# EAGLE design Memory V1.2 (EAGLE 9.6.2)

## Sheet 1 of 6: BUS
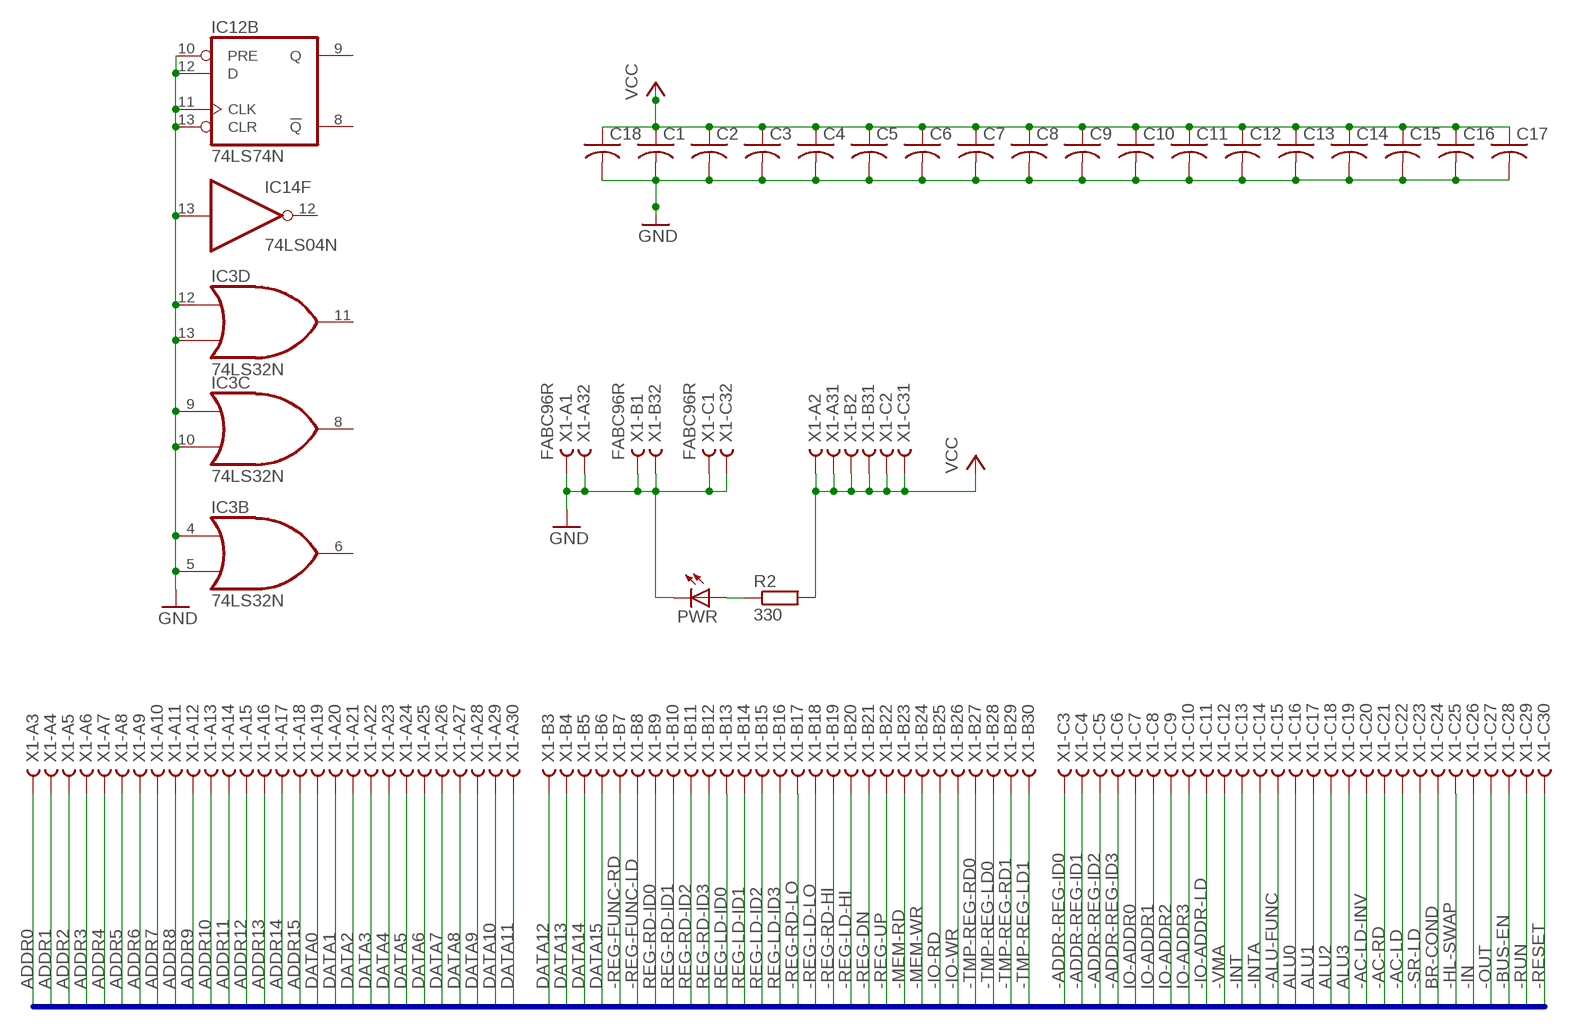
[diagram p0: schematic, sheet 1]

### Parts
C1  C-US025-025X050  [C025-025X050]
C2  C-US025-025X050  [C025-025X050]
C3  C-US025-025X050  [C025-025X050]
C4  C-US025-025X050  [C025-025X050]
C5  C-US025-025X050  [C025-025X050]
C6  C-US025-025X050  [C025-025X050]
C7  C-US025-025X050  [C025-025X050]
C8  C-US025-025X050  [C025-025X050]
C9  C-US025-025X050  [C025-025X050]
C10  C-US025-025X050  [C025-025X050]
C11  C-US025-025X050  [C025-025X050]
C12  C-US025-025X050  [C025-025X050]
C13  C-US025-025X050  [C025-025X050]
C14  C-US025-025X050  [C025-025X050]
C15  C-US025-025X050  [C025-025X050]
C16  C-US025-025X050  [C025-025X050]
C17  C-US025-025X050  [C025-025X050]
C18  C-US025-025X050  [C025-025X050]
IC3  74LS32N  [DIL14]
IC12  74LS74N  [DIL14]
IC14  74LS04N  [DIL14]
PWR  LED5MM  [LED5MM]
R2  330  R0207/10  [0207/10]
X1  FABC96R  [FABC96R]

### Nets
-AC-LD: X1.C22
-AC-LD-INV: X1.C20
-AC-RD: X1.C21
-ADDR-REG-ID0: X1.C3
-ADDR-REG-ID1: X1.C4
-ADDR-REG-ID2: X1.C5
-ADDR-REG-ID3: X1.C6
-ALU-FUNC: X1.C15
-BUS-EN: X1.C28 ; also sheet 2
-HL-SWAP: X1.C25
-IN: X1.C26
-INT: X1.C13
-INTA: X1.C14
-IO-ADDR-LD: X1.C11
-IO-RD: X1.B25
-IO-WR: X1.B26
-MEM-RD: X1.B23 ; also sheet 3,5
-MEM-WR: X1.B24 ; also sheet 3
-OUT: X1.C27
-REG-DN: X1.B21
-REG-FUNC-LD: X1.B8
-REG-FUNC-RD: X1.B7
-REG-LD-HI: X1.B20
-REG-LD-LO: X1.B18
-REG-RD-HI: X1.B19
-REG-RD-LO: X1.B17
-REG-UP: X1.B22
-RESET: X1.C30 ; also sheet 2
-RUN: X1.C29
-SR-LD: X1.C23
-TMP-REG-LD0: X1.B28 ; also sheet 6
-TMP-REG-LD1: X1.B30 ; also sheet 6
-TMP-REG-RD0: X1.B27 ; also sheet 6
-TMP-REG-RD1: X1.B29 ; also sheet 6
-VMA: X1.C12 ; also sheet 2,3,5
ADDR0: X1.A3 ; also sheet 4
ADDR1: X1.A4 ; also sheet 4
ADDR2: X1.A5 ; also sheet 4
ADDR3: X1.A6 ; also sheet 4
ADDR4: X1.A7 ; also sheet 4
ADDR5: X1.A8 ; also sheet 4
ADDR6: X1.A9 ; also sheet 4
ADDR7: X1.A10 ; also sheet 4
ADDR8: X1.A11 ; also sheet 4
ADDR9: X1.A12 ; also sheet 4
ADDR10: X1.A13 ; also sheet 4
ADDR11: X1.A14 ; also sheet 4
ADDR12: X1.A15 ; also sheet 4
ADDR13: X1.A16 ; also sheet 4
ADDR14: X1.A17 ; also sheet 4
ADDR15: X1.A18 ; also sheet 2,4
ALU0: X1.C16
ALU1: X1.C17
ALU2: X1.C18
ALU3: X1.C19
BR-COND: X1.C24
DATA0: X1.A19 ; also sheet 5,6
DATA1: X1.A20 ; also sheet 5,6
DATA2: X1.A21 ; also sheet 5,6
DATA3: X1.A22 ; also sheet 5,6
DATA4: X1.A23 ; also sheet 5,6
DATA5: X1.A24 ; also sheet 5,6
DATA6: X1.A25 ; also sheet 5,6
DATA7: X1.A26 ; also sheet 5,6
DATA8: X1.A27 ; also sheet 6
DATA9: X1.A28 ; also sheet 6
DATA10: X1.A29 ; also sheet 6
DATA11: X1.A30 ; also sheet 6
DATA12: X1.B3 ; also sheet 6
DATA13: X1.B4 ; also sheet 6
DATA14: X1.B5 ; also sheet 6
DATA15: X1.B6 ; also sheet 6
GND: C1.2 C2.2 C3.2 C4.2 C5.2 C6.2 C7.2 C8.2 C9.2 C10.2 C11.2 C12.2 C13.2 C14.2 C15.2 C16.2 C17.2 C18.2 IC3.4(B:I0) IC3.5(B:I1) IC3.9(C:I0) IC3.10(C:I1) IC3.12(D:I0) IC3.13(D:I1) IC12.10(B:PRE) IC12.11(B:CLK) IC12.12(B:D) IC12.13(B:CLR) IC14.13(F:I) PWR.K(C) X1.A1 X1.A32 X1.B1 X1.B32 X1.C1 X1.C32 ; also sheet 2,3,4,6
IO-ADDR0: X1.C7
IO-ADDR1: X1.C8
IO-ADDR2: X1.C9
IO-ADDR3: X1.C10
N$11: PWR.A R2.1
REG-LD-ID0: X1.B13
REG-LD-ID1: X1.B14
REG-LD-ID2: X1.B15
REG-LD-ID3: X1.B16
REG-RD-ID0: X1.B9
REG-RD-ID1: X1.B10
REG-RD-ID2: X1.B11
REG-RD-ID3: X1.B12
VCC: C1.1 C2.1 C3.1 C4.1 C5.1 C6.1 C7.1 C8.1 C9.1 C10.1 C11.1 C12.1 C13.1 C14.1 C15.1 C16.1 C17.1 C18.1 R2.2 X1.A2 X1.A31 X1.B2 X1.B31 X1.C2 X1.C31 ; also sheet 2,3,4,5
Unconnected: IC3.6(B:O) IC3.8(C:O) IC3.11(D:O) IC12.8(B:!Q) IC12.9(B:Q) IC14.12(F:O)

### Buses
MAINBUS:-AC-LD,-AC-LD-INV,-AC-RD,ADDR[0..15],-ADDR-REG-LD[0..1],-ADDR-REG-RD[0..1],ALU[0..3],-ALU-FUNC,BR-COND,-BUS-EN,DATA[0..15],-HL-SWAP,-IN,-INT,-INTA,IO-ADDR[0..3],-IO-ADDR-LD,-IO-RD,-IO-WR,-MEM-RD,-MEM-WR,-OUT,-REG-DN,-REG-FUNC-LD,-REG-FUNC-RD,-REG-LD-HI,REG-LD-ID[0..3],-REG-LD-LO,-REG-RD-HI,REG-RD-ID[0..3],-REG-RD-LO,-REG-UP,-RESET,-RUN,-SR-LD,-TMP-REG-LD[0..1],-TMP-REG-RD[0..1],-VMA

## Sheet 2 of 6: Memory Select
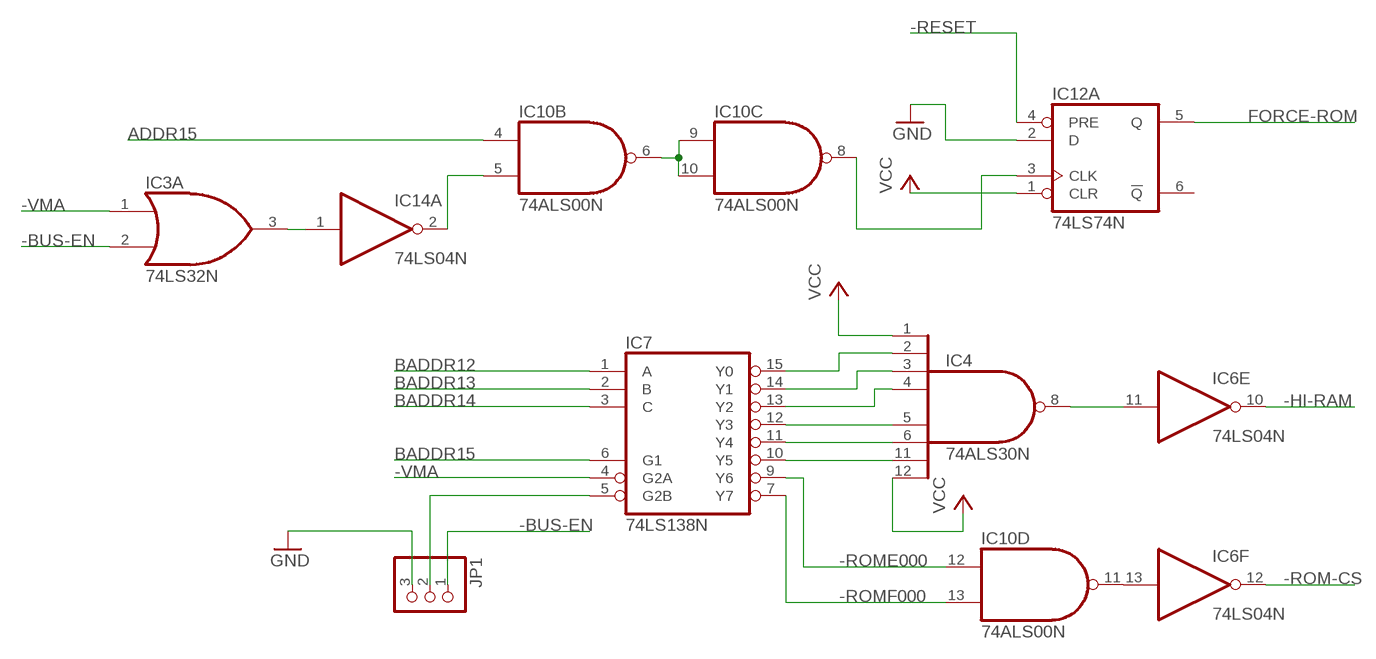
[diagram p1: schematic, sheet 2]

### Parts
IC4  74ALS30N  [DIL14]
IC6  74LS04N  [DIL14]
IC7  74LS138N  [DIL16]
IC10  74ALS00N  [DIL14]
JP1  PINHD-1X3  [1X03]

### Nets
-BUS-EN: IC3.2(A:I1) JP1.1 ; also sheet 1
-HI-RAM: IC6.10(E:O) ; also sheet 3
-RESET: IC12.4(A:PRE) ; also sheet 1
-ROM-CS: IC6.12(F:O) ; also sheet 3
-ROME000: IC7.9(Y6) IC10.12(D:I0)
-ROMF000: IC7.7(Y7) IC10.13(D:I1)
-VMA: IC3.1(A:I0) IC7.4(G2A) ; also sheet 1,3,5
ADDR15: IC10.4(B:I0) ; also sheet 1,4
BADDR12: IC7.1(A) ; also sheet 3,4
BADDR13: IC7.2(B) ; also sheet 3,4
BADDR14: IC7.3(C) ; also sheet 3,4
BADDR15: IC7.6(G1) ; also sheet 3,4
FORCE-ROM: IC12.5(A:Q) ; also sheet 4
GND: IC12.2(A:D) JP1.3 ; also sheet 1,3,4,6
N$1: IC6.13(F:I) IC10.11(D:O)
N$5: IC4.11(I6) IC7.10(Y5)
N$6: IC4.6(I5) IC7.11(Y4)
N$7: IC4.5(I4) IC7.12(Y3)
N$8: IC4.4(I3) IC7.13(Y2)
N$9: IC4.3(I2) IC7.14(Y1)
N$10: IC4.2(I1) IC7.15(Y0)
N$14: IC4.8(O) IC6.11(E:I)
N$19: IC10.8(C:O) IC12.3(A:CLK)
N$20: IC10.6(B:O) IC10.9(C:I0) IC10.10(C:I1)
N$22: IC10.5(B:I1) IC14.2(A:O)
N$24: IC7.5(G2B) JP1.2
N$25: IC3.3(A:O) IC14.1(A:I)
VCC: IC4.1(I0) IC4.12(I7) IC12.1(A:CLR) ; also sheet 1,3,4,5
Unconnected: IC12.6(A:!Q)

## Sheet 3 of 6: Memory
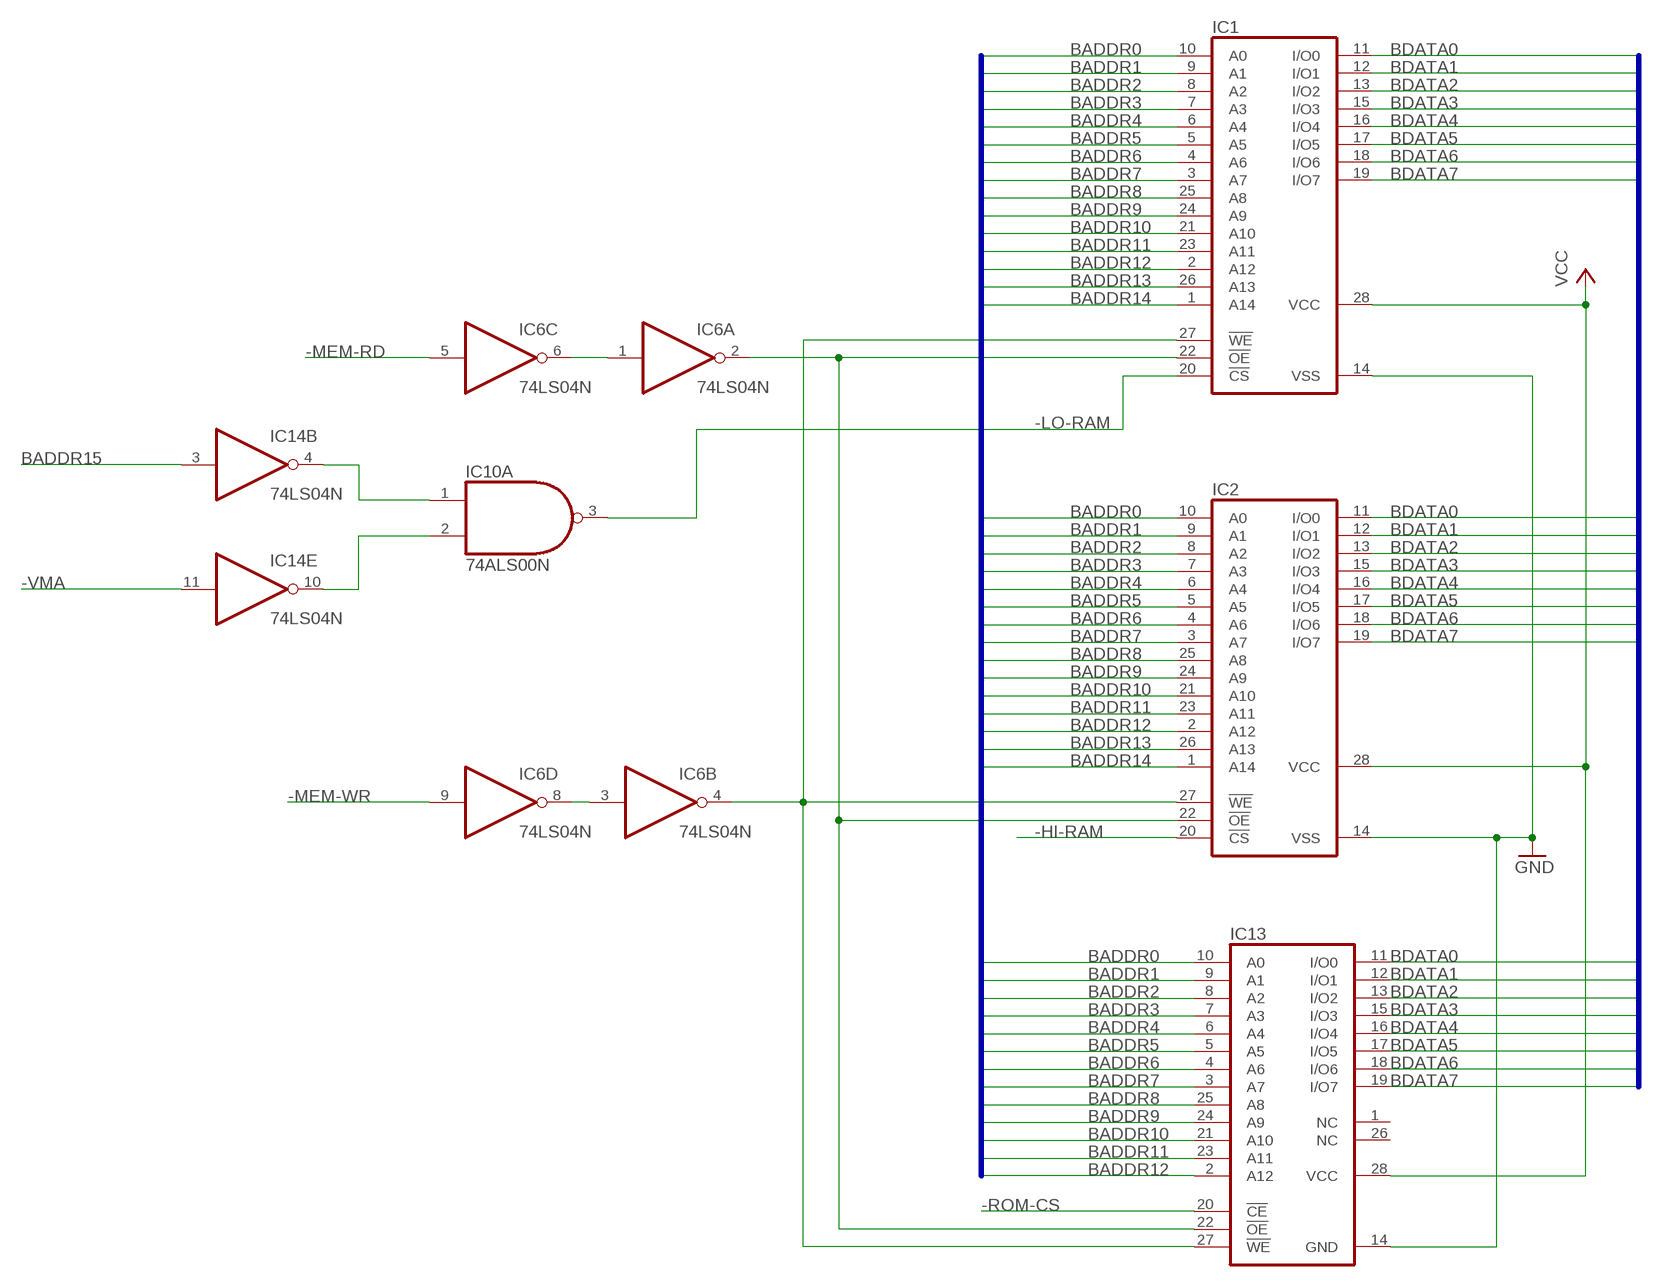
[diagram p2: schematic, sheet 3]

### Parts
IC1  62256P  [DIL28-6]
IC2  62256P  [DIL28-6]
IC13  28C64C  [DIL28-6]

### Nets
-HI-RAM: IC2.20(!CS) ; also sheet 2
-LO-RAM: IC1.20(!CS) IC10.3(A:O)
-MEM-RD: IC6.5(C:I) ; also sheet 1,5
-MEM-WR: IC6.9(D:I) ; also sheet 1
-ROM-CS: IC13.20(!CE) ; also sheet 2
-VMA: IC14.11(E:I) ; also sheet 1,2,5
BADDR0: IC1.10(A0) IC2.10(A0) IC13.10(A0) ; also sheet 4
BADDR1: IC1.9(A1) IC2.9(A1) IC13.9(A1) ; also sheet 4
BADDR2: IC1.8(A2) IC2.8(A2) IC13.8(A2) ; also sheet 4
BADDR3: IC1.7(A3) IC2.7(A3) IC13.7(A3) ; also sheet 4
BADDR4: IC1.6(A4) IC2.6(A4) IC13.6(A4) ; also sheet 4
BADDR5: IC1.5(A5) IC2.5(A5) IC13.5(A5) ; also sheet 4
BADDR6: IC1.4(A6) IC2.4(A6) IC13.4(A6) ; also sheet 4
BADDR7: IC1.3(A7) IC2.3(A7) IC13.3(A7) ; also sheet 4
BADDR8: IC1.25(A8) IC2.25(A8) IC13.25(A8) ; also sheet 4
BADDR9: IC1.24(A9) IC2.24(A9) IC13.24(A9) ; also sheet 4
BADDR10: IC1.21(A10) IC2.21(A10) IC13.21(A10) ; also sheet 4
BADDR11: IC1.23(A11) IC2.23(A11) IC13.23(A11) ; also sheet 4
BADDR12: IC1.2(A12) IC2.2(A12) IC13.2(A12) ; also sheet 2,4
BADDR13: IC1.26(A13) IC2.26(A13) ; also sheet 2,4
BADDR14: IC1.1(A14) IC2.1(A14) ; also sheet 2,4
BADDR15: IC14.3(B:I) ; also sheet 2,4
BDATA0: IC1.11(I/O0) IC2.11(I/O0) IC13.11(I/O0) ; also sheet 5
BDATA1: IC1.12(I/O1) IC2.12(I/O1) IC13.12(I/O1) ; also sheet 5
BDATA2: IC1.13(I/O2) IC2.13(I/O2) IC13.13(I/O2) ; also sheet 5
BDATA3: IC1.15(I/O3) IC2.15(I/O3) IC13.15(I/O3) ; also sheet 5
BDATA4: IC1.16(I/O4) IC2.16(I/O4) IC13.16(I/O4) ; also sheet 5
BDATA5: IC1.17(I/O5) IC2.17(I/O5) IC13.17(I/O5) ; also sheet 5
BDATA6: IC1.18(I/O6) IC2.18(I/O6) IC13.18(I/O6) ; also sheet 5
BDATA7: IC1.19(I/O7) IC2.19(I/O7) IC13.19(I/O7) ; also sheet 5
GND: IC1.14(VSS) IC2.14(VSS) IC13.14(GND) ; also sheet 1,2,4,6
MEM-RD: IC6.1(A:I) IC6.6(C:O)
N$2: IC6.3(B:I) IC6.8(D:O)
N$3: IC1.22(!OE) IC2.22(!OE) IC6.2(A:O) IC13.22(!OE)
N$4: IC1.27(!WE) IC2.27(!WE) IC6.4(B:O) IC13.27(!WE)
N$12: IC10.2(A:I1) IC14.10(E:O)
N$13: IC10.1(A:I0) IC14.4(B:O)
VCC: IC1.28(VCC) IC2.28(VCC) IC13.28(VCC) ; also sheet 1,2,4,5
Unconnected: IC13.1(NC) IC13.26(NC)

### Buses
BADDR[0..15]
BDATA[0..7]

## Sheet 4 of 6: Adress Buffering
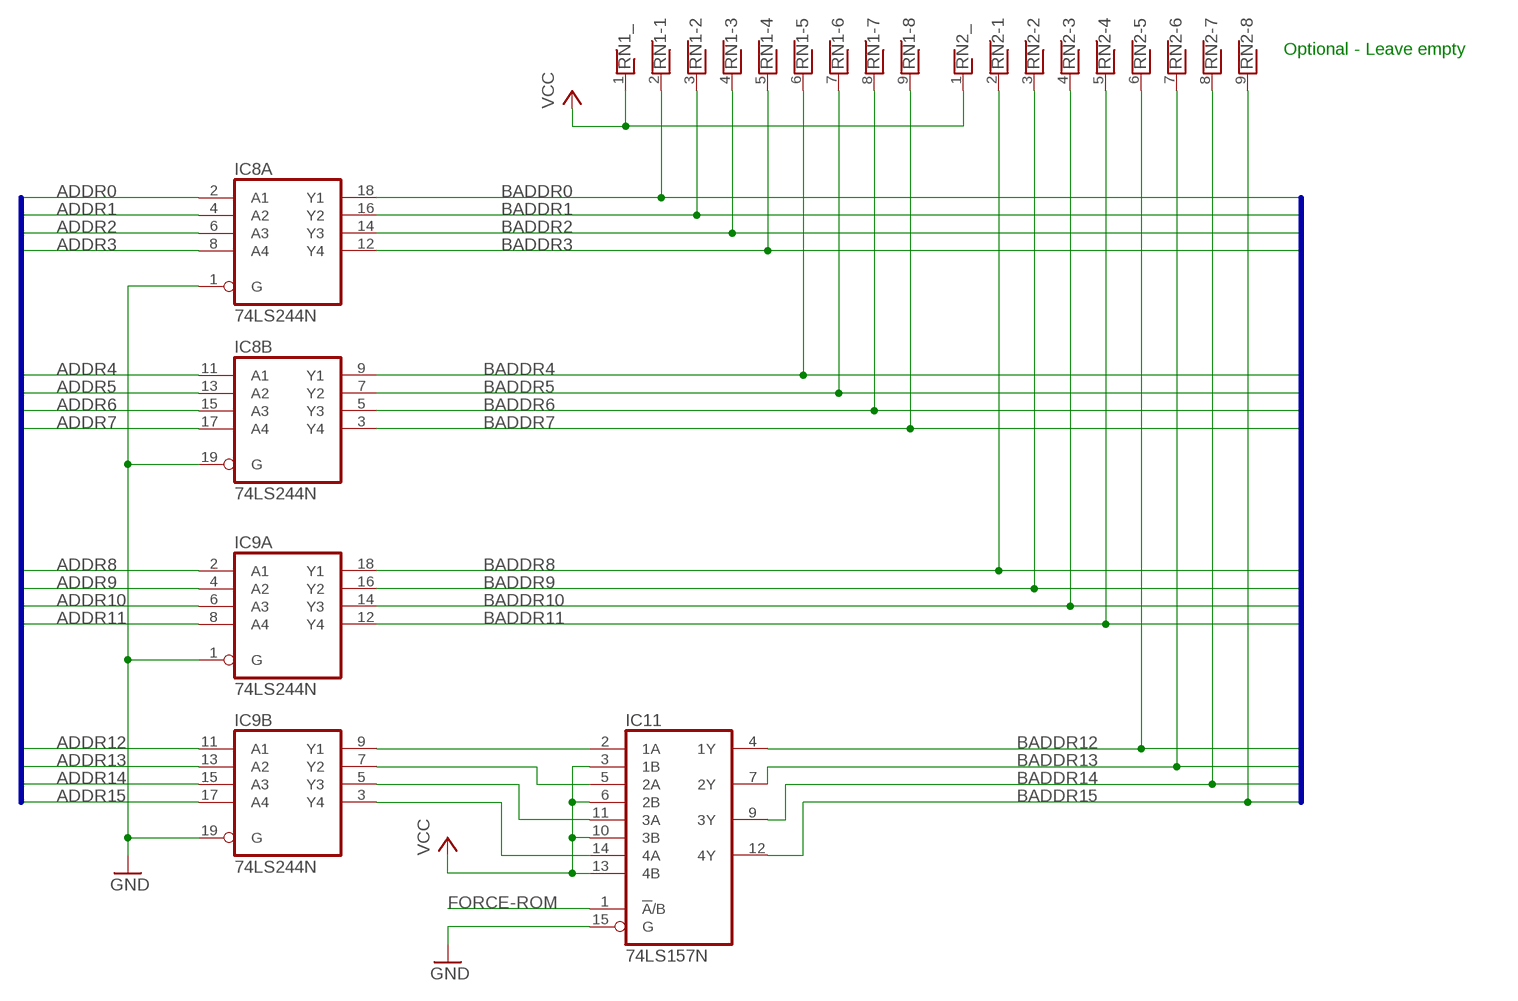
[diagram p3: schematic, sheet 4]

### Parts
IC8  74LS244N  [DIL20]
IC9  74LS244N  [DIL20]
IC11  74LS157N  [DIL16]
RN1  RNX8  [RN-9]
RN2  RNX8  [RN-9]

### Nets
ADDR0: IC8.2(A:A1) ; also sheet 1
ADDR1: IC8.4(A:A2) ; also sheet 1
ADDR2: IC8.6(A:A3) ; also sheet 1
ADDR3: IC8.8(A:A4) ; also sheet 1
ADDR4: IC8.11(B:A1) ; also sheet 1
ADDR5: IC8.13(B:A2) ; also sheet 1
ADDR6: IC8.15(B:A3) ; also sheet 1
ADDR7: IC8.17(B:A4) ; also sheet 1
ADDR8: IC9.2(A:A1) ; also sheet 1
ADDR9: IC9.4(A:A2) ; also sheet 1
ADDR10: IC9.6(A:A3) ; also sheet 1
ADDR11: IC9.8(A:A4) ; also sheet 1
ADDR12: IC9.11(B:A1) ; also sheet 1
ADDR13: IC9.13(B:A2) ; also sheet 1
ADDR14: IC9.15(B:A3) ; also sheet 1
ADDR15: IC9.17(B:A4) ; also sheet 1,2
BADDR0: IC8.18(A:Y1) RN1.2 ; also sheet 3
BADDR1: IC8.16(A:Y2) RN1.3 ; also sheet 3
BADDR2: IC8.14(A:Y3) RN1.4 ; also sheet 3
BADDR3: IC8.12(A:Y4) RN1.5 ; also sheet 3
BADDR4: IC8.9(B:Y1) RN1.6 ; also sheet 3
BADDR5: IC8.7(B:Y2) RN1.7 ; also sheet 3
BADDR6: IC8.5(B:Y3) RN1.8 ; also sheet 3
BADDR7: IC8.3(B:Y4) RN1.9 ; also sheet 3
BADDR8: IC9.18(A:Y1) RN2.2 ; also sheet 3
BADDR9: IC9.16(A:Y2) RN2.3 ; also sheet 3
BADDR10: IC9.14(A:Y3) RN2.4 ; also sheet 3
BADDR11: IC9.12(A:Y4) RN2.5 ; also sheet 3
BADDR12: IC11.4(1Y) RN2.6 ; also sheet 2,3
BADDR13: IC11.7(2Y) RN2.7 ; also sheet 2,3
BADDR14: IC11.9(3Y) RN2.8 ; also sheet 2,3
BADDR15: IC11.12(4Y) RN2.9 ; also sheet 2,3
FORCE-ROM: IC11.1(!A!/B) ; also sheet 2
GND: IC8.1(A:G) IC8.19(B:G) IC9.1(A:G) IC9.19(B:G) IC11.15(G) ; also sheet 1,2,3,6
N$15: IC9.9(B:Y1) IC11.2(1A)
N$16: IC9.7(B:Y2) IC11.5(2A)
N$17: IC9.5(B:Y3) IC11.11(3A)
N$18: IC9.3(B:Y4) IC11.14(4A)
VCC: IC11.3(1B) IC11.6(2B) IC11.10(3B) IC11.13(4B) RN1.1 RN2.1 ; also sheet 1,2,3,5

### Buses
ADDR0,ADDR1,ADDR2,ADDR3,ADDR4,ADDR5,ADDR6,ADDR7,ADDR8,ADDR9,ADDR10,ADDR11,ADDR12,ADDR13,ADDR14,ADDR15
BADDR[0..15]

### Notes on the sheet
- Optional - Leave empty

## Sheet 5 of 6: Data Buffer
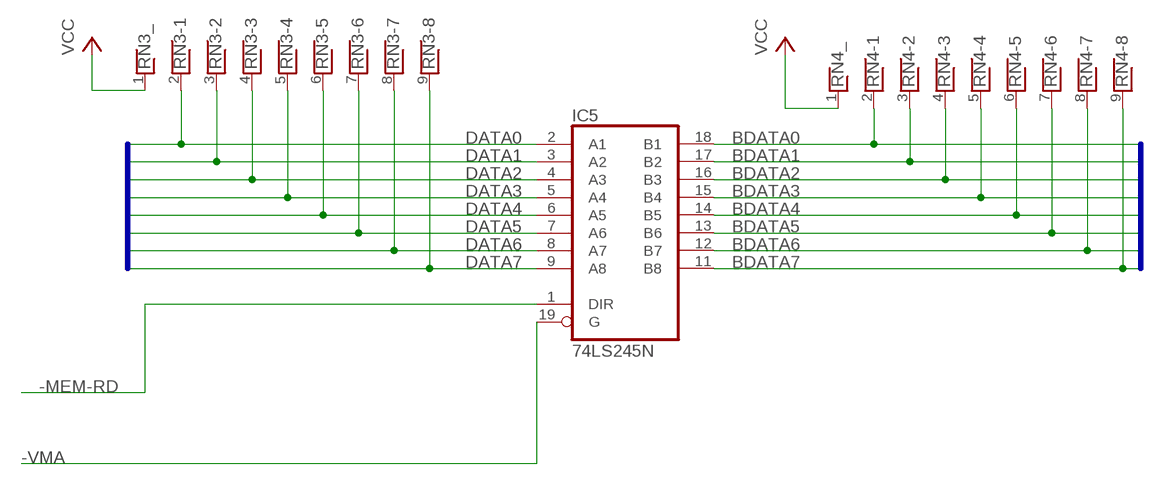
[diagram p4: schematic, sheet 5]

### Parts
IC5  74LS245N  [DIL20]
RN3  RNX8  [RN-9]
RN4  RNX8  [RN-9]

### Nets
-MEM-RD: IC5.1(DIR) ; also sheet 1,3
-VMA: IC5.19(G) ; also sheet 1,2,3
BDATA0: IC5.18(B1) RN4.2 ; also sheet 3
BDATA1: IC5.17(B2) RN4.3 ; also sheet 3
BDATA2: IC5.16(B3) RN4.4 ; also sheet 3
BDATA3: IC5.15(B4) RN4.5 ; also sheet 3
BDATA4: IC5.14(B5) RN4.6 ; also sheet 3
BDATA5: IC5.13(B6) RN4.7 ; also sheet 3
BDATA6: IC5.12(B7) RN4.8 ; also sheet 3
BDATA7: IC5.11(B8) RN4.9 ; also sheet 3
DATA0: IC5.2(A1) RN3.2 ; also sheet 1,6
DATA1: IC5.3(A2) RN3.3 ; also sheet 1,6
DATA2: IC5.4(A3) RN3.4 ; also sheet 1,6
DATA3: IC5.5(A4) RN3.5 ; also sheet 1,6
DATA4: IC5.6(A5) RN3.6 ; also sheet 1,6
DATA5: IC5.7(A6) RN3.7 ; also sheet 1,6
DATA6: IC5.8(A7) RN3.8 ; also sheet 1,6
DATA7: IC5.9(A8) RN3.9 ; also sheet 1,6
VCC: RN3.1 RN4.1 ; also sheet 1,2,3,4

### Buses
DATA[0..7]
BDATA0,BDATA1,BDATA2,BDATA3,BDATA4,BDATA5,BDATA6,BDATA7

## Sheet 6 of 6
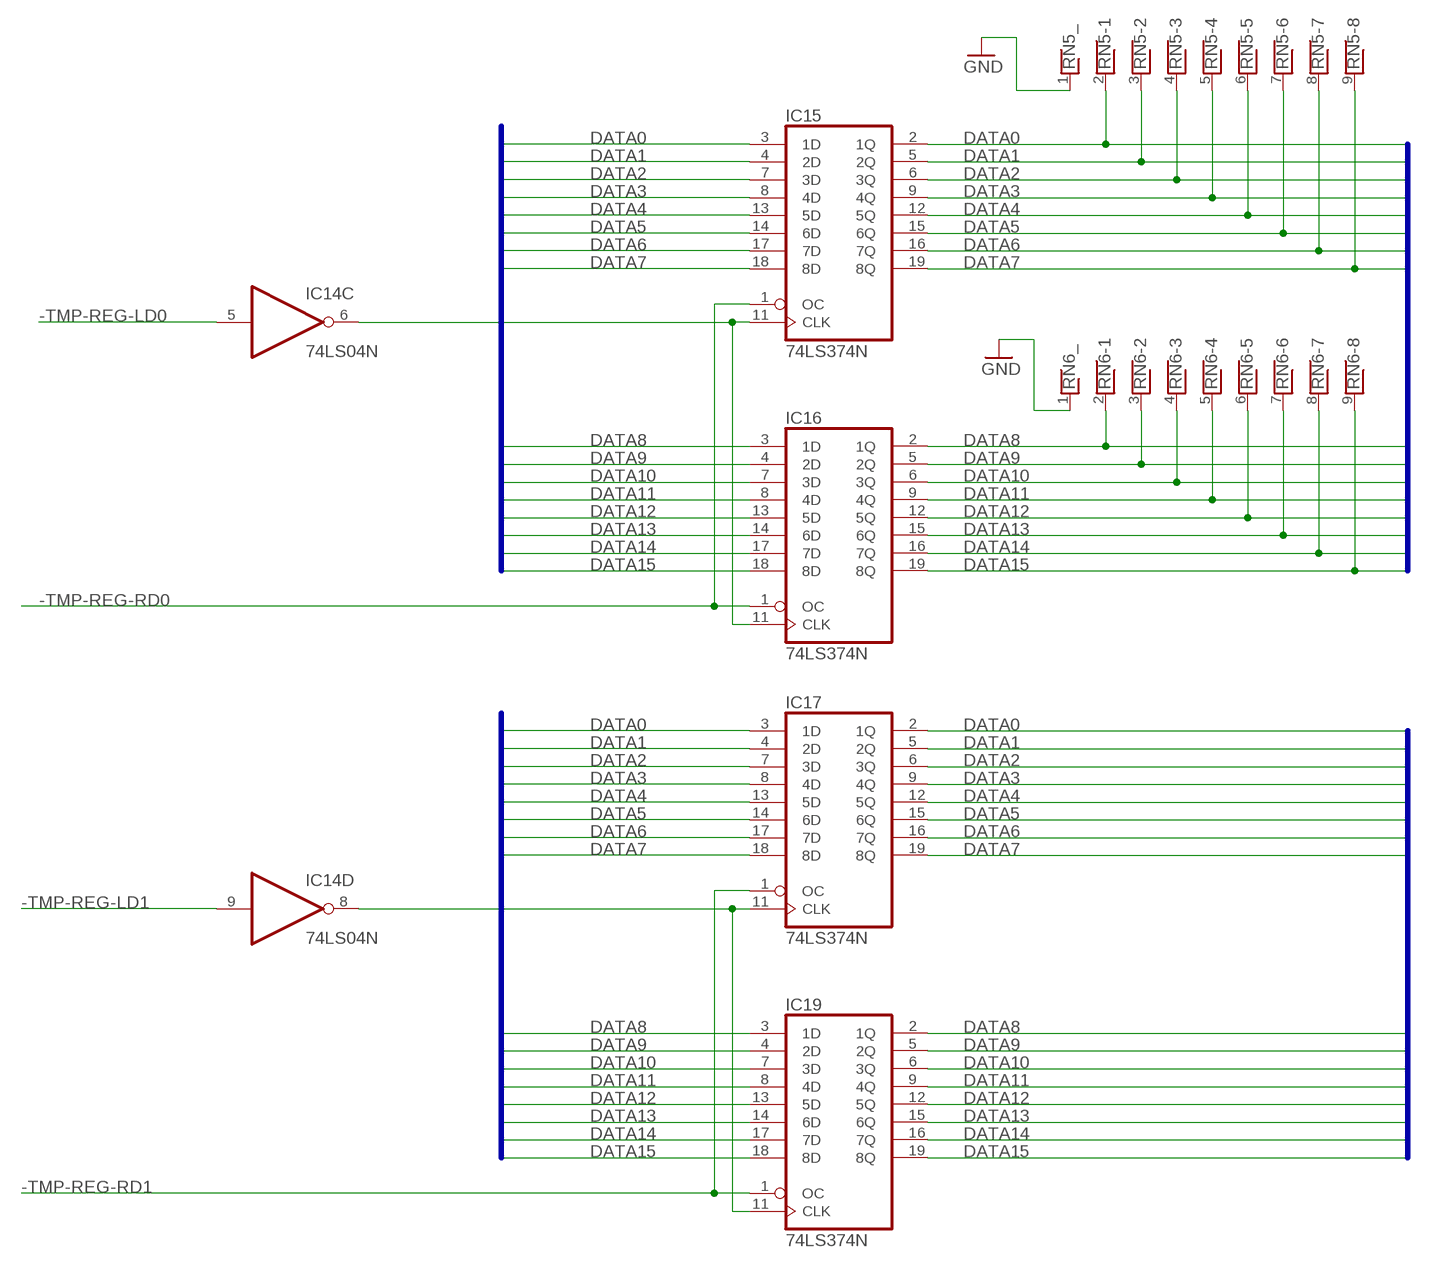
[diagram p5: schematic, sheet 6]

### Parts
IC15  74LS374N  [DIL20]
IC16  74LS374N  [DIL20]
IC17  74LS374N  [DIL20]
IC19  74LS374N  [DIL20]
RN5  RNX8  [RN-9]
RN6  RNX8  [RN-9]

### Nets
-TMP-REG-LD0: IC14.5(C:I) ; also sheet 1
-TMP-REG-LD1: IC14.9(D:I) ; also sheet 1
-TMP-REG-RD0: IC15.1(OC) IC16.1(OC) ; also sheet 1
-TMP-REG-RD1: IC17.1(OC) IC19.1(OC) ; also sheet 1
DATA0: IC15.2(1Q) IC15.3(1D) IC17.2(1Q) IC17.3(1D) RN5.2 ; also sheet 1,5
DATA1: IC15.4(2D) IC15.5(2Q) IC17.4(2D) IC17.5(2Q) RN5.3 ; also sheet 1,5
DATA2: IC15.6(3Q) IC15.7(3D) IC17.6(3Q) IC17.7(3D) RN5.4 ; also sheet 1,5
DATA3: IC15.8(4D) IC15.9(4Q) IC17.8(4D) IC17.9(4Q) RN5.5 ; also sheet 1,5
DATA4: IC15.12(5Q) IC15.13(5D) IC17.12(5Q) IC17.13(5D) RN5.6 ; also sheet 1,5
DATA5: IC15.14(6D) IC15.15(6Q) IC17.14(6D) IC17.15(6Q) RN5.7 ; also sheet 1,5
DATA6: IC15.16(7Q) IC15.17(7D) IC17.16(7Q) IC17.17(7D) RN5.8 ; also sheet 1,5
DATA7: IC15.18(8D) IC15.19(8Q) IC17.18(8D) IC17.19(8Q) RN5.9 ; also sheet 1,5
DATA8: IC16.2(1Q) IC16.3(1D) IC19.2(1Q) IC19.3(1D) RN6.2 ; also sheet 1
DATA9: IC16.4(2D) IC16.5(2Q) IC19.4(2D) IC19.5(2Q) RN6.3 ; also sheet 1
DATA10: IC16.6(3Q) IC16.7(3D) IC19.6(3Q) IC19.7(3D) RN6.4 ; also sheet 1
DATA11: IC16.8(4D) IC16.9(4Q) IC19.8(4D) IC19.9(4Q) RN6.5 ; also sheet 1
DATA12: IC16.12(5Q) IC16.13(5D) IC19.12(5Q) IC19.13(5D) RN6.6 ; also sheet 1
DATA13: IC16.14(6D) IC16.15(6Q) IC19.14(6D) IC19.15(6Q) RN6.7 ; also sheet 1
DATA14: IC16.16(7Q) IC16.17(7D) IC19.16(7Q) IC19.17(7D) RN6.8 ; also sheet 1
DATA15: IC16.18(8D) IC16.19(8Q) IC19.18(8D) IC19.19(8Q) RN6.9 ; also sheet 1
GND: RN5.1 RN6.1 ; also sheet 1,2,3,4
N$21: IC14.6(C:O) IC15.11(CLK) IC16.11(CLK)
N$23: IC14.8(D:O) IC17.11(CLK) IC19.11(CLK)

### Buses
DATABUS:DATA[0..15]

## Power pins joined to a net without a drawn wire
GND: IC3.7(P:GND) IC4.7(GND) IC5.10(GND) IC6.7(P:GND) IC7.8(GND) IC8.10(P:GND) IC9.10(P:GND) IC10.7(P:GND) IC11.8(GND) IC12.7(P:GND) IC14.7(P:GND) IC15.10(GND) IC16.10(GND) IC17.10(GND) IC19.10(GND)
VCC: IC3.14(P:VCC) IC4.14(VCC) IC5.20(VCC) IC6.14(P:VCC) IC7.16(VCC) IC8.20(P:VCC) IC9.20(P:VCC) IC10.14(P:VCC) IC11.16(VCC) IC12.14(P:VCC) IC14.14(P:VCC) IC15.20(VCC) IC16.20(VCC) IC17.20(VCC) IC19.20(VCC)

## Library data of the parts
C1-C18 = adafruit:C-US: CAPACITOR, American symbol
IC1 IC2 = memory-hitachi:62256P: MEMORY; OC_FARNELL: unknown; OC_NEWARK: unknown
IC3 = 74xx-us:74*32: Quad 2-input OR gate
IC4 = 74xx-us:74*30: 8-input NAND gate
IC5 = adafruit:74*245: Octal BUS TRANSCEIVER, 3-state
IC6 IC14 = 74xx-us:74*04: Hex INVERTER
IC7 = 74xx-us:74*138: 3-line to 8-line DECODER/DEMULTIPLEXER
IC8 IC9 = 74xx-us:74*244: Octal BUFFER and LINE DRIVER, 3-state
IC10 = 74xx-us:74*00: Quad 2-input NAND gate
IC11 = 74xx-us:74*157: Quadruple 2-line to 1-line data SELECTOR/MULTIPLEXER
IC12 = 74xx-us:74*74: Dual D type positive edge triggered FLIP FLOP, preset and clear
IC13 = memory-nec:28C64C: MEMORY; MPN: AT28C64B-15PU; OC_FARNELL: 1095784; OC_NEWARK: 96K6557
IC15-IC17 IC19 = 74xx-us:74*374: Octal D type transparent LATCH, edge triggered
JP1 = pinhead:PINHD-1X3: PIN HEADER
PWR = led:LED: LED OSRAM: - CHIPLED LG R971, LG N971, LY N971, LG Q971, LY Q971, LO R971, LY R971 LH N974, LH R974 LS Q976, LO Q976, LY Q976 LO Q996 - Hyper CHIPLED LW Q18S LB Q993, LB Q99A, LB R99A - SideLED LS A670, LO A670, LY A670, LG A670, LP A670 LB A673, LV A673, LT A673, LW A673 LH A674 LY A675 LS A676, LA A676, LO A676, LY A676, LW A676 LS A679, LY A679, LG A679 - Hyper Micro SIDELED® LS Y876, LA Y876, LO Y876, LY Y876 LT Y87S - SmartLED LW L88C, LW L88S LB L89C, LB L89S, LG L890 LS L89K, LO L89K, LY L89K LS L896, LA L896, LO L896, LY L896 - TOPLED LS T670, LO T670, LY T670, LG T670, LP T670 LSG T670, LSP T670, LSY T670, LOP T670, LYG T670 LG T671, LOG T671, LSG T671 LB T673, LV T673, LT T673, LW T673 LH T674 LS T676, LA T676, LO T676, LY T676, LB T676, LH T676, LSB T676, LW T676 LB T67C, LV T67C, LT T67C, LS T67K, LO T67K, LY T67K, LW E67C LS E67B, LA E67B, LO E67B, LY E67B, LB E67C, LV E67C, LT E67C LW T67C LS T679, LY T679, LG T679 LS T770, LO T770, LY T770, LG T770, LP T770 LB T773, LV T773, LT T773, LW T773 LH T774 LS E675, LA E675, LY E675, LS T675 LS T776, LA T776, LO T776, LY T776, LB T776 LHGB T686 LT T68C, LB T68C - Hyper Mini TOPLED® LB M676 - Mini TOPLED Santana® LG M470 LS M47K, LO M47K, LY M47K Source: http://www.osram.convergy.de LUXEON: - LUMILED® LXK2-PW12-R00, LXK2-PW12-S00, LXK2-PW14-U00, LXK2-PW14-V00 LXK2-PM12-R00, LXK2-PM12-S00, LXK2-PM14-U00 LXK2-PE12-Q00, LXK2-PE12-R00, LXK2-PE12-S00, LXK2-PE14-T00, LXK2-PE14-U00 LXK2-PB12-K00, LXK2-PB12-L00, LXK2-PB12-M00, LXK2-PB14-N00, LXK2-PB14-P00, LXK2-PB14-Q00 LXK2-PR12-L00, LXK2-PR12-M00, LXK2-PR14-Q00, LXK2-PR14-R00 LXK2-PD12-Q00, LXK2-PD12-R00, LXK2-PD12-S00 LXK2-PH12-R00, LXK2-PH12-S00 LXK2-PL12-P00, LXK2-PL12-Q00, LXK2-PL12-R00 Source: www.luxeon.com KINGBRIGHT: KA-3528ASYC Source: www.kingbright.com
R2 = eagle-ltspice:R: RESISTOR, European symbol; SPICEMODEL: NONE; SPICEPREFIX: R
RN1-RN6 = resistor-net:RNX8: RESISTOR NETWORK; OC_FARNELL: unknown; OC_NEWARK: unknown
X1 = con-vg:FABC96R: CONNECTOR female, 96 pins, type R, rows ABC, grid 2.54 mm

## Net classes
1 GND: width 1 mm
2 5V: width 1 mm

## Board
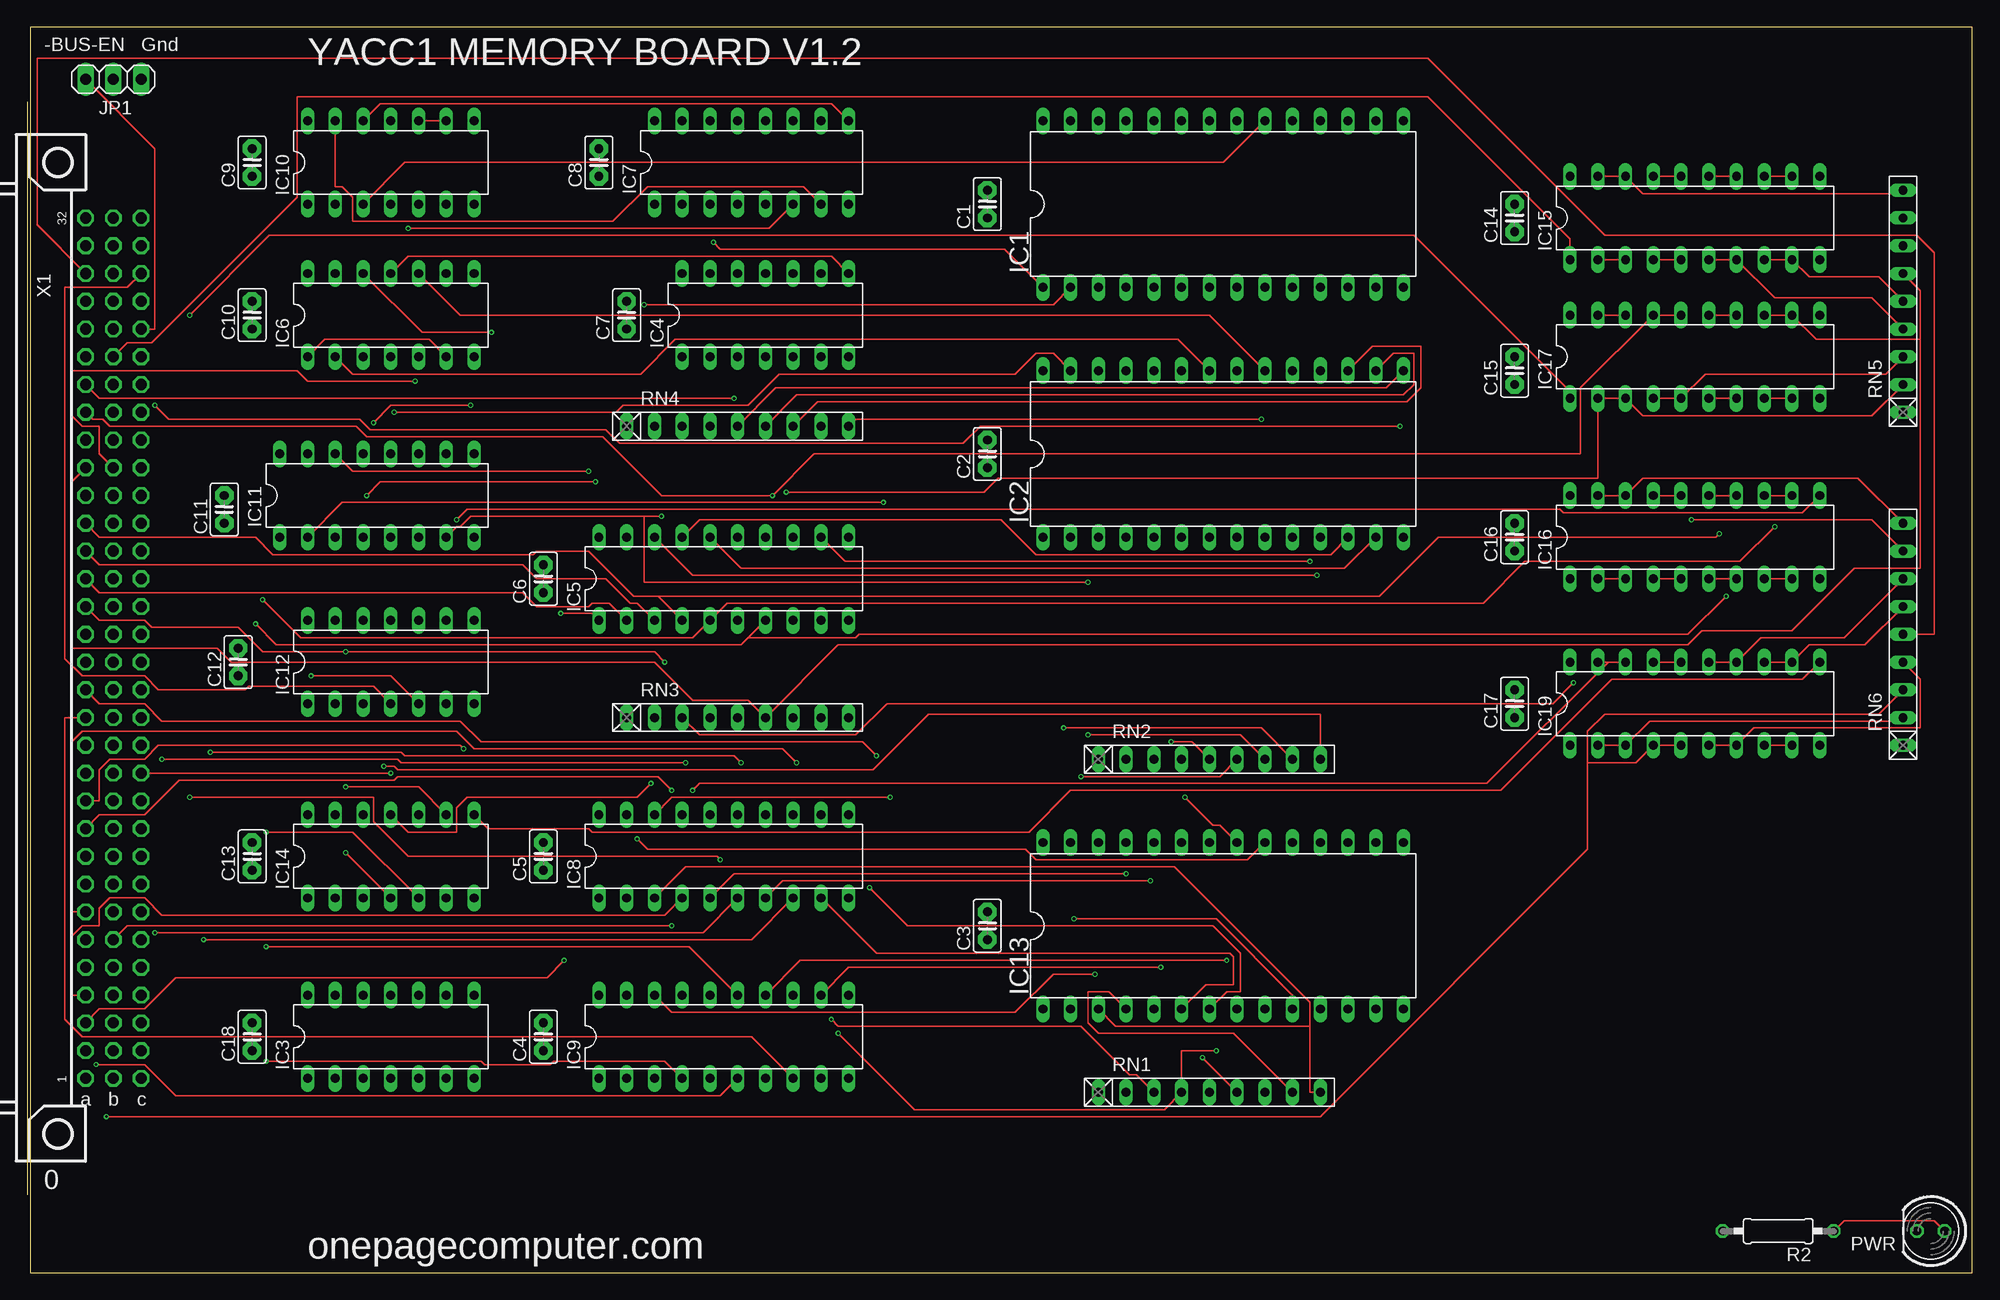
[diagram p6: board, top side]
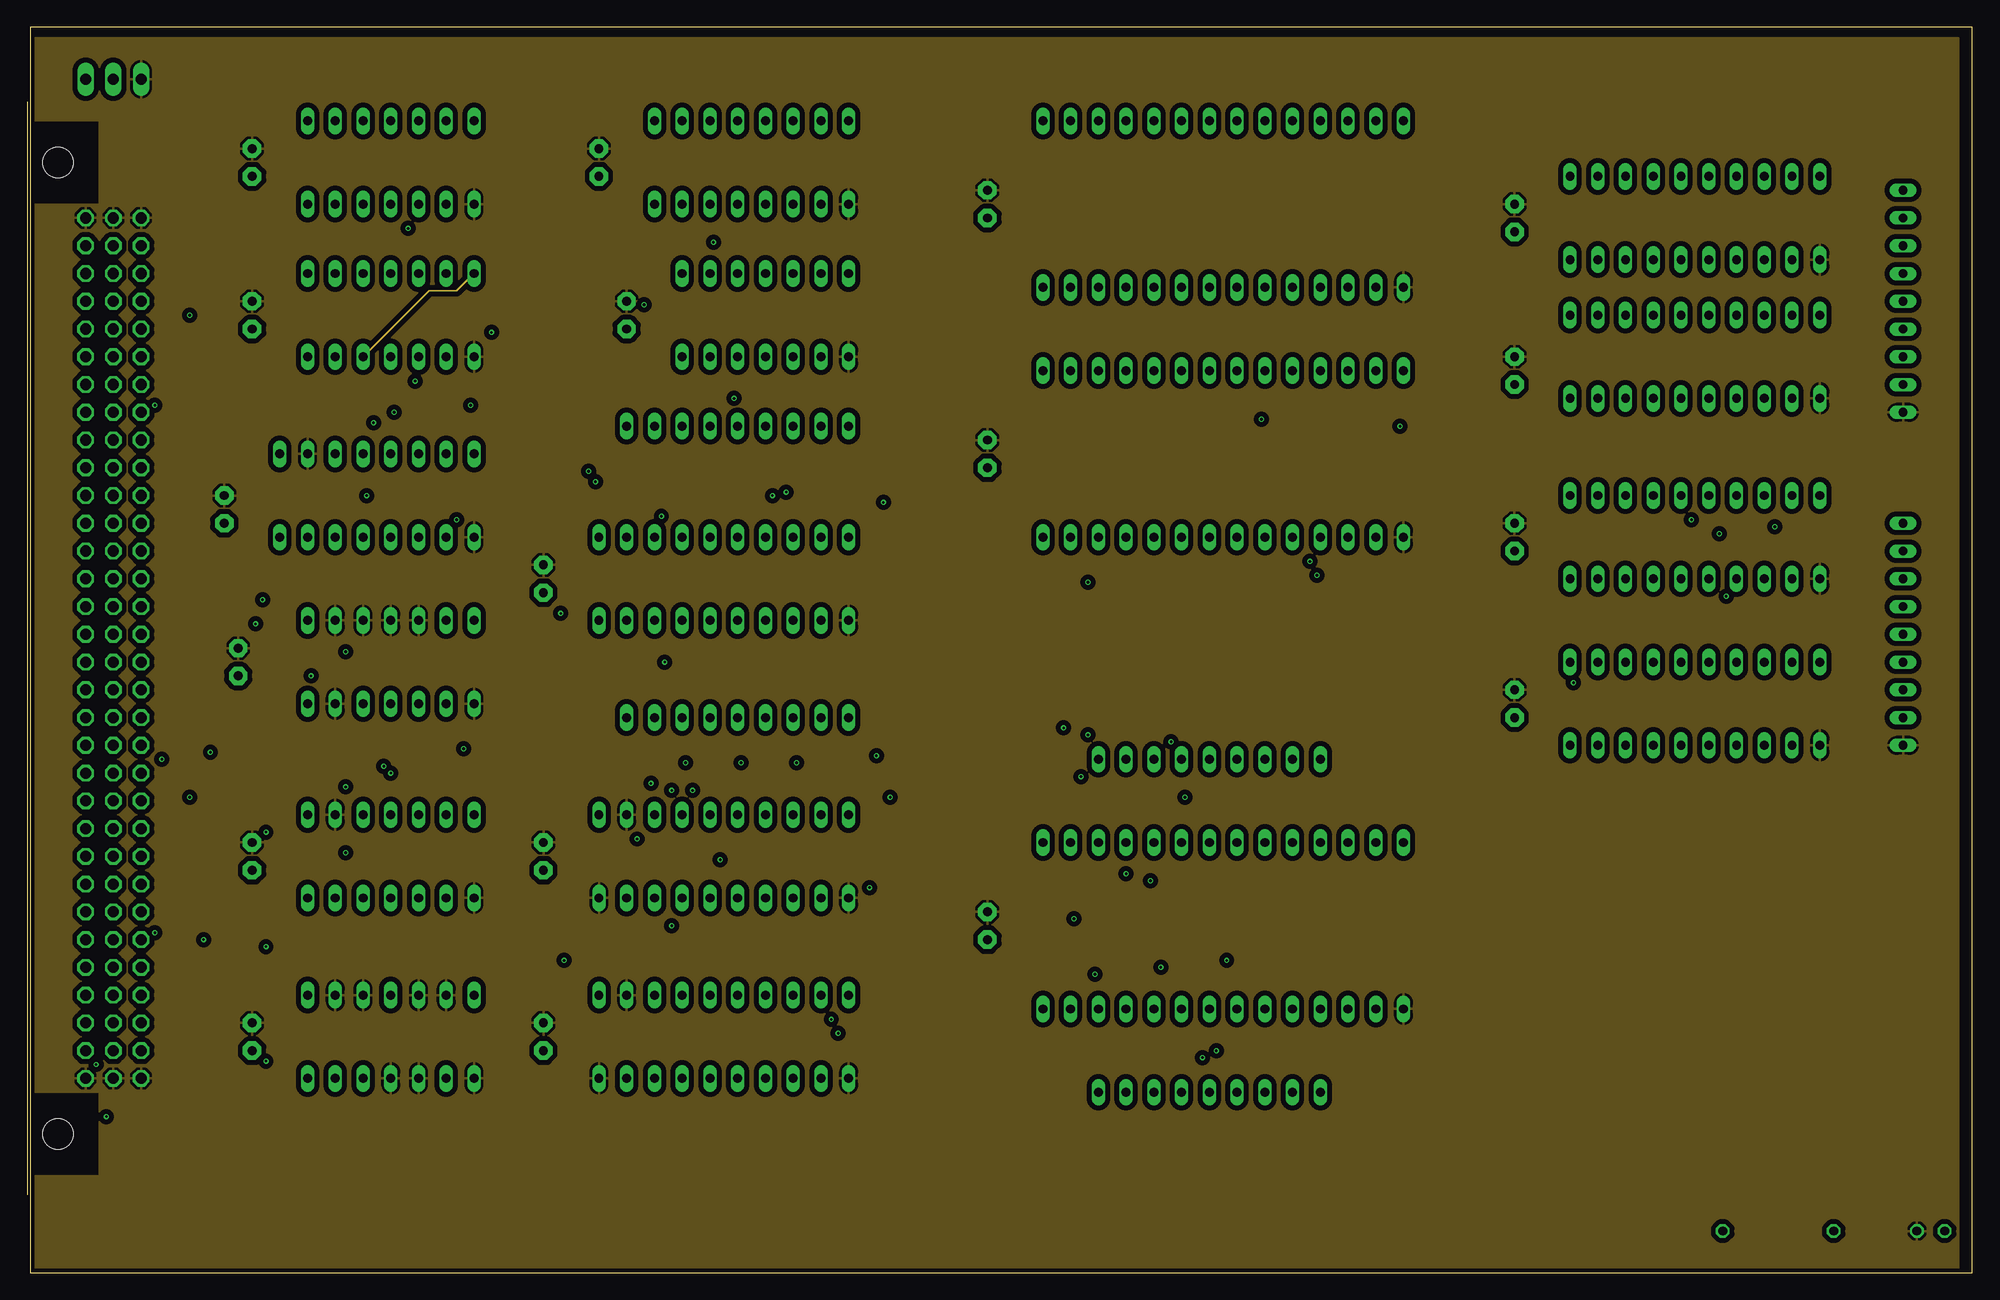
[diagram p7: board, inner layer Route2]
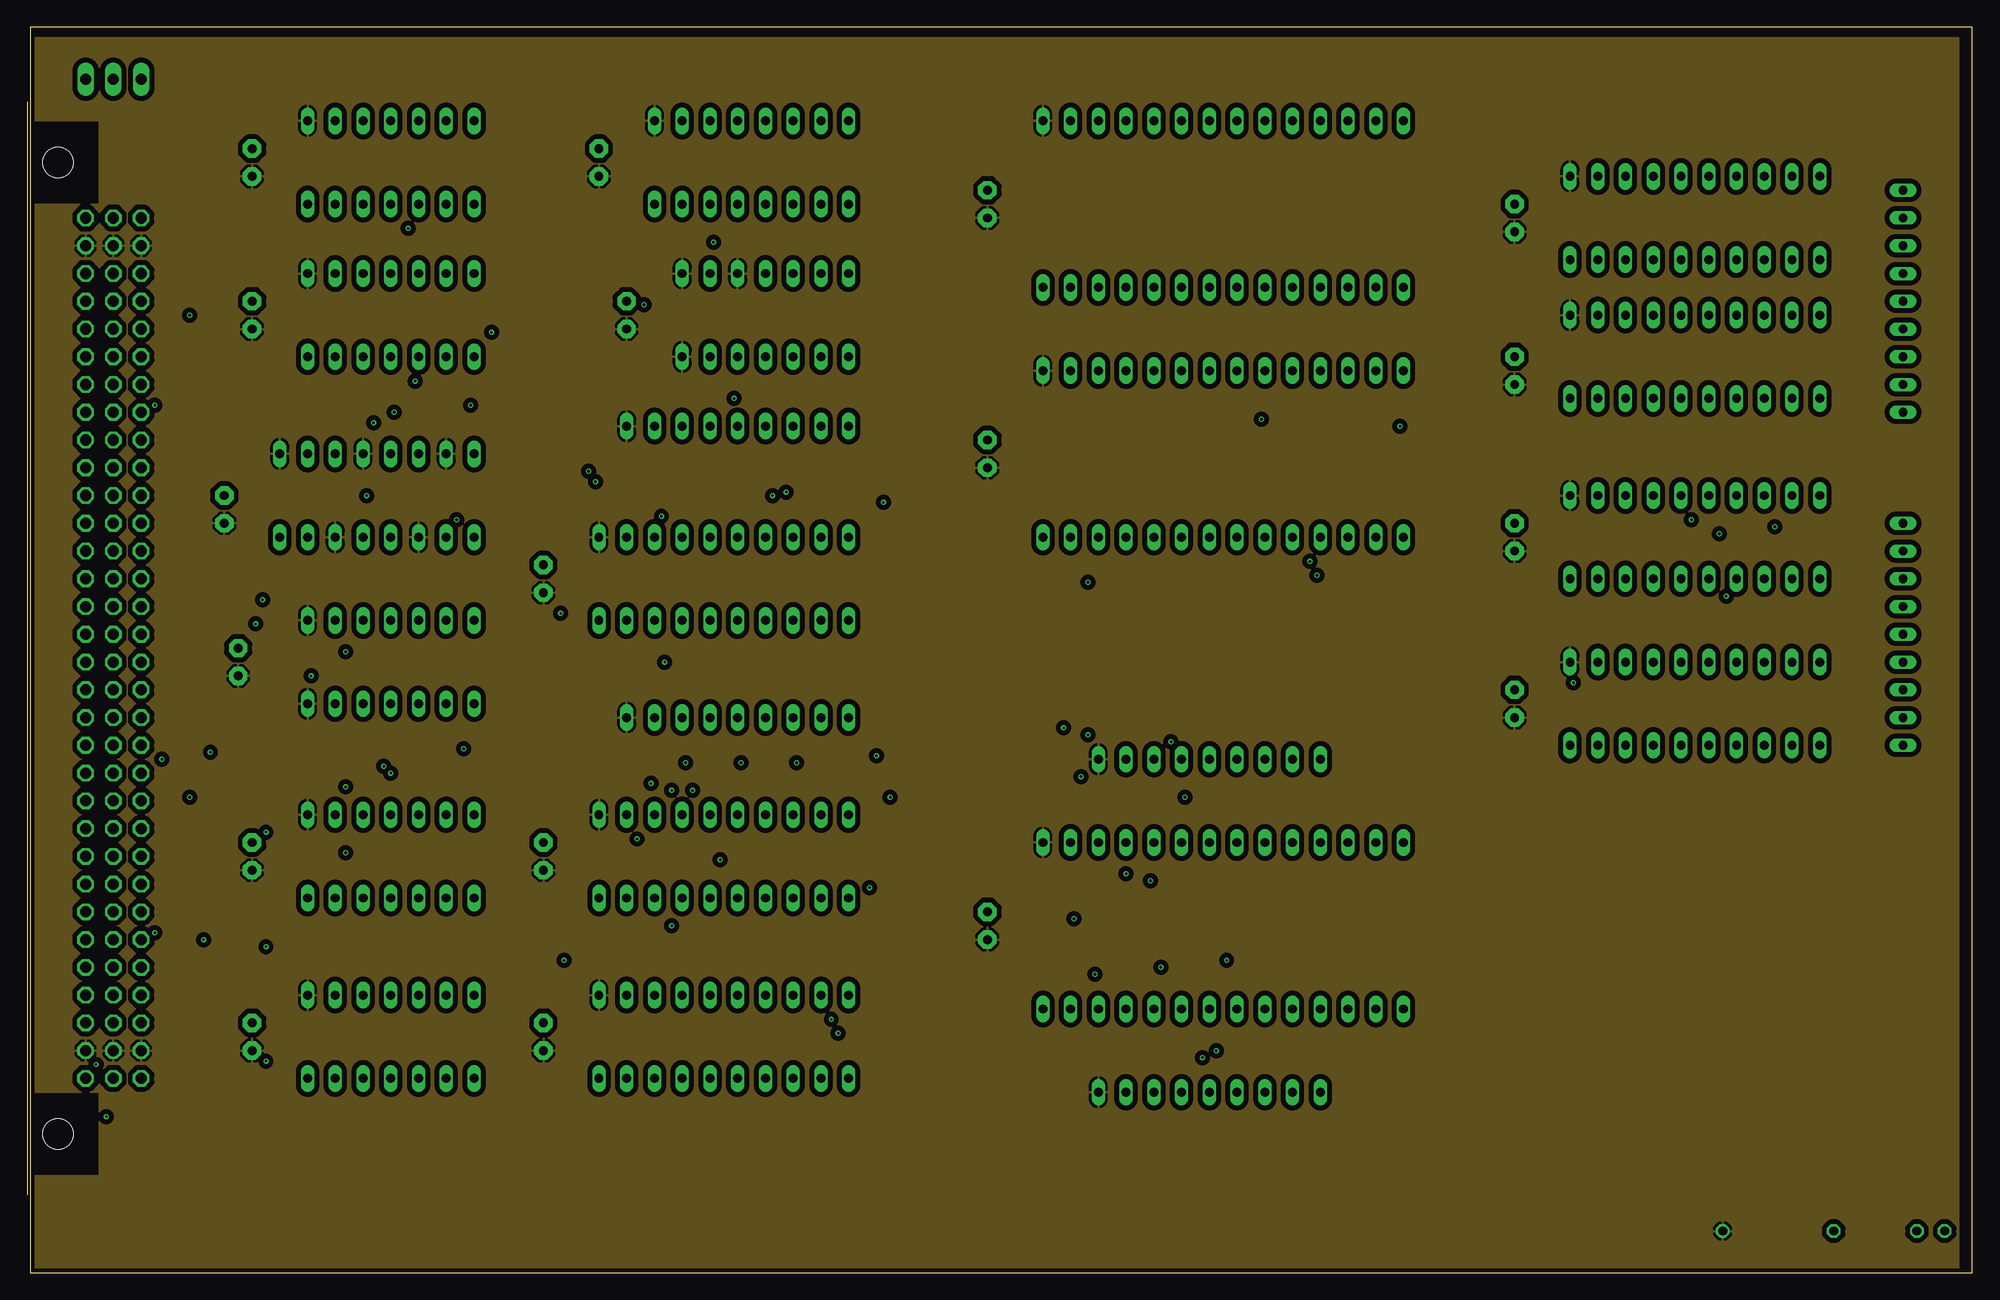
[diagram p8: board, inner layer Route15]
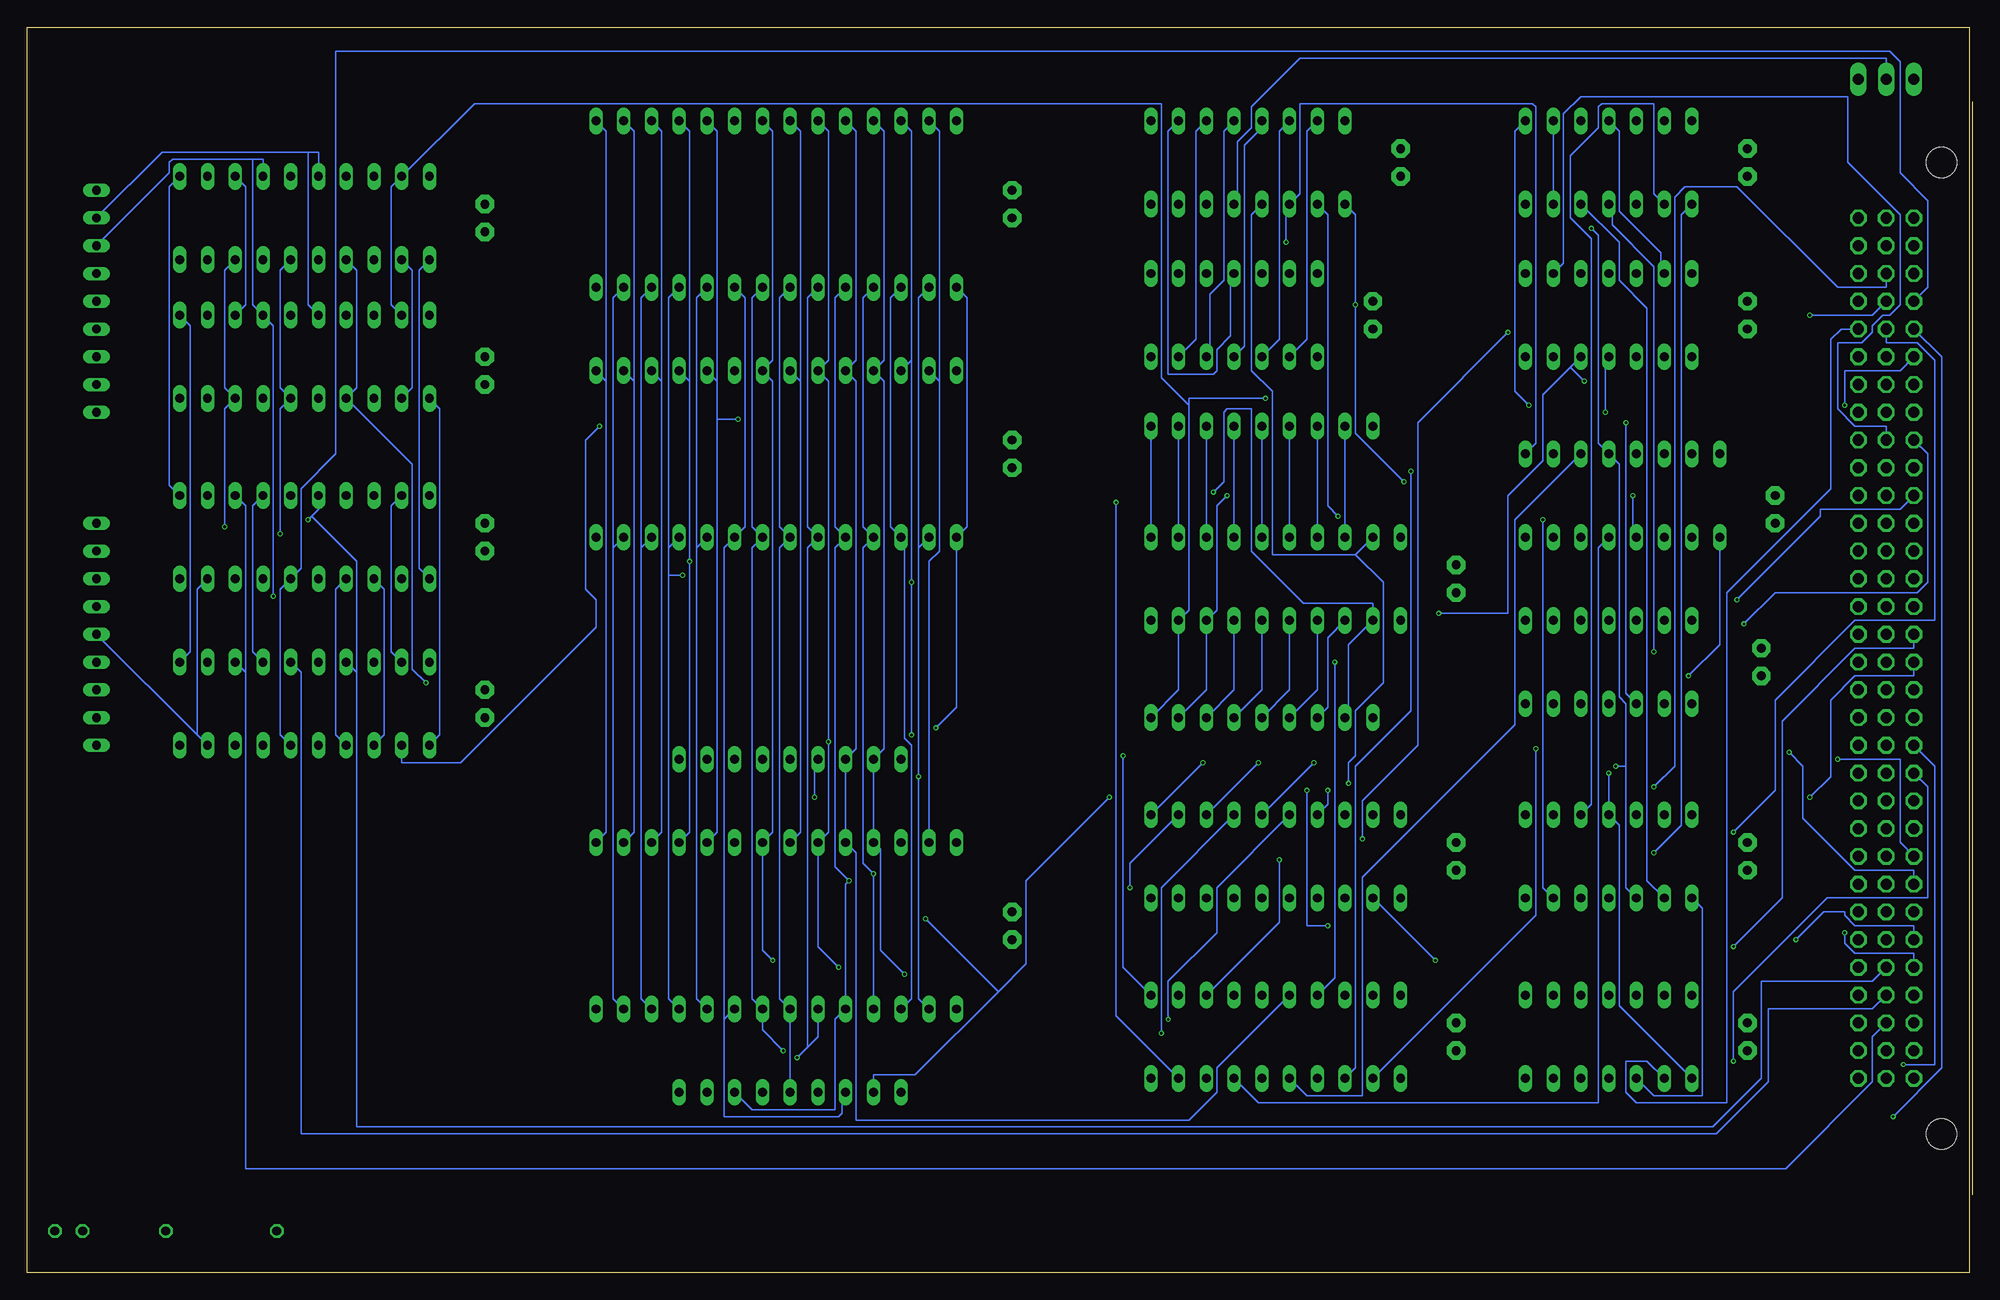
[diagram p9: board, bottom side, seen from below]

Size 177.78 x 113.97 mm. Coordinates in mm from the lower left corner, seen from the top.
Outline: 0,0 177.78,0 177.78,113.97 0,113.97 0,0
Copper layers (1*2*15*16): Top 0.035559375mm / dielectric 0.17018125mm / Route2 0.01778125mm / dielectric 47mil / Route15 0.01778125mm / dielectric 0.17018125mm / Bottom 0.035559375mm
Design rules "oshpark-4layer *": minimum track width 6mil, minimum drill 10mil, track to track 18mil, track to pad 10mil, pad to pad 5mil, via to via 5mil, smd to smd 5mil, copper to edge 15mil, drill to drill 6mil, minimum pad ring 4mil, minimum via ring 4mil, stop-mask expansion 2.5mil, vias tented up to drill 0mil, thermal gap 10mil

### Footprints (pad centres in the part's own frame; a part is rotated, then mirrored left to right if it is on the bottom)
C025-025X050 = drill 0.813 pad 1.676 octagon: 1 -1.27,0; 2 1.27,0
DIL28-6 = drill 0.813 long: 1 -16.51,-7.62; 2 -13.97,-7.62; 3 -11.43,-7.62; 4 -8.89,-7.62; 5 -6.35,-7.62; 6 -3.81,-7.62; 7 -1.27,-7.62; 8 1.27,-7.62; 9 3.81,-7.62; 10 6.35,-7.62; 11 8.89,-7.62; 12 11.43,-7.62; 13 13.97,-7.62; 14 16.51,-7.62; 15 16.51,7.62; 16 13.97,7.62; 17 11.43,7.62; 18 8.89,7.62; 19 6.35,7.62; 20 3.81,7.62; 21 1.27,7.62; 22 -1.27,7.62; 23 -3.81,7.62; 24 -6.35,7.62; 25 -8.89,7.62; 26 -11.43,7.62; 27 -13.97,7.62; 28 -16.51,7.62
DIL14 = drill 0.813 long: 1 -7.62,-3.81; 2 -5.08,-3.81; 3 -2.54,-3.81; 4 0,-3.81; 5 2.54,-3.81; 6 5.08,-3.81; 7 7.62,-3.81; 8 7.62,3.81; 9 5.08,3.81; 10 2.54,3.81; 11 0,3.81; 12 -2.54,3.81; 13 -5.08,3.81; 14 -7.62,3.81
DIL20 = drill 0.813 long: 1 -11.43,-3.81; 2 -8.89,-3.81; 3 -6.35,-3.81; 4 -3.81,-3.81; 5 -1.27,-3.81; 6 1.27,-3.81; 7 3.81,-3.81; 8 6.35,-3.81; 9 8.89,-3.81; 10 11.43,-3.81; 11 11.43,3.81; 12 8.89,3.81; 13 6.35,3.81; 14 3.81,3.81; 15 1.27,3.81; 16 -1.27,3.81; 17 -3.81,3.81; 18 -6.35,3.81; 19 -8.89,3.81; 20 -11.43,3.81
DIL16 = drill 0.813 long: 1 -8.89,-3.81; 2 -6.35,-3.81; 3 -3.81,-3.81; 4 -1.27,-3.81; 5 1.27,-3.81; 6 3.81,-3.81; 7 6.35,-3.81; 8 8.89,-3.81; 9 8.89,3.81; 10 6.35,3.81; 11 3.81,3.81; 12 1.27,3.81; 13 -1.27,3.81; 14 -3.81,3.81; 15 -6.35,3.81; 16 -8.89,3.81
1X03 = drill 1.016 long: 1 -2.54,0; 2 0,0; 3 2.54,0
LED5MM = drill 0.813 octagon: A -1.27,0; K 1.27,0
0207/10 = drill 0.813 octagon: 1 -5.08,0; 2 5.08,0
RN-9 = drill 0.813 long: 1 -10.16,0; 2 -7.62,0; 3 -5.08,0; 4 -2.54,0; 5 0,0; 6 2.54,0; 7 5.08,0; 8 7.62,0; 9 10.16,0
FABC96R = drill 1.016 octagon: A1 -2.54,39.37; A2 -2.54,36.83; A3 -2.54,34.29; A4 -2.54,31.75; A5 -2.54,29.21; A6 -2.54,26.67; A7 -2.54,24.13; A8 -2.54,21.59; A9 -2.54,19.05; A10 -2.54,16.51; A11 -2.54,13.97; A12 -2.54,11.43; A13 -2.54,8.89; A14 -2.54,6.35; A15 -2.54,3.81; A16 -2.54,1.27; A17 -2.54,-1.27; A18 -2.54,-3.81; A19 -2.54,-6.35; A20 -2.54,-8.89; A21 -2.54,-11.43; A22 -2.54,-13.97; A23 -2.54,-16.51; A24 -2.54,-19.05; A25 -2.54,-21.59; A26 -2.54,-24.13; A27 -2.54,-26.67; A28 -2.54,-29.21; A29 -2.54,-31.75; A30 -2.54,-34.29; A31 -2.54,-36.83; A32 -2.54,-39.37; B1 -5.08,39.37; B2 -5.08,36.83; B3 -5.08,34.29; B4 -5.08,31.75; B5 -5.08,29.21; B6 -5.08,26.67; B7 -5.08,24.13; B8 -5.08,21.59; B9 -5.08,19.05; B10 -5.08,16.51; B11 -5.08,13.97; B12 -5.08,11.43; B13 -5.08,8.89; B14 -5.08,6.35; B15 -5.08,3.81; B16 -5.08,1.27; B17 -5.08,-1.27; B18 -5.08,-3.81; B19 -5.08,-6.35; B20 -5.08,-8.89; B21 -5.08,-11.43; B22 -5.08,-13.97; B23 -5.08,-16.51; B24 -5.08,-19.05; B25 -5.08,-21.59; B26 -5.08,-24.13; B27 -5.08,-26.67; B28 -5.08,-29.21; B29 -5.08,-31.75; B30 -5.08,-34.29; B31 -5.08,-36.83; B32 -5.08,-39.37; C1 -7.62,39.37; C2 -7.62,36.83; C3 -7.62,34.29; C4 -7.62,31.75; C5 -7.62,29.21; C6 -7.62,26.67; C7 -7.62,24.13; C8 -7.62,21.59; C9 -7.62,19.05; C10 -7.62,16.51; C11 -7.62,13.97; C12 -7.62,11.43; C13 -7.62,8.89; C14 -7.62,6.35; C15 -7.62,3.81; C16 -7.62,1.27; C17 -7.62,-1.27; C18 -7.62,-3.81; C19 -7.62,-6.35; C20 -7.62,-8.89; C21 -7.62,-11.43; C22 -7.62,-13.97; C23 -7.62,-16.51; C24 -7.62,-19.05; C25 -7.62,-21.59; C26 -7.62,-24.13; C27 -7.62,-26.67; C28 -7.62,-29.21; C29 -7.62,-31.75; C30 -7.62,-34.29; C31 -7.62,-36.83; C32 -7.62,-39.37 | hole 2.794: 0,-44.456; 0,44.456

### Placement (x,y rotation side)
C1  87.63,97.79 90 top
C2  87.63,74.93 90 top
C3  87.63,31.75 90 top
C4  46.99,21.59 90 top
C5  46.99,38.1 90 top
C6  46.99,63.5 90 top
C7  54.61,87.63 90 top
C8  52.07,101.6 90 top
C9  20.32,101.6 90 top
C10  20.32,87.63 90 top
C11  17.78,69.85 90 top
C12  19.05,55.88 90 top
C13  20.32,38.1 90 top
C14  135.89,96.52 90 top
C15  135.89,82.55 90 top
C16  135.89,67.31 90 top
C17  135.89,52.07 90 top
C18  20.32,21.59 90 top
IC1  109.22,97.79 0 top
IC2  109.22,74.93 0 top
IC3  33.02,21.59 0 top
IC4  67.31,87.63 0 top
IC5  63.5,63.5 0 top
IC6  33.02,87.63 0 top
IC7  66.04,101.6 0 top
IC8  63.5,38.1 0 top
IC9  63.5,21.59 0 top
IC10  33.02,101.6 0 top
IC11  31.75,71.12 0 top
IC12  33.02,55.88 0 top
IC13  109.22,31.75 0 top
IC14  33.02,38.1 0 top
IC15  152.4,96.52 0 top
IC16  152.4,67.31 0 top
IC17  152.4,83.82 0 top
IC19  152.4,52.07 0 top
JP1  7.62,109.22 0 top
PWR  173.99,3.81 180 top
R2  160.02,3.81 180 top
RN1  107.95,16.51 0 top
RN2  107.95,46.99 0 top
RN3  64.77,50.8 0 top
RN4  64.77,77.47 0 top
RN5  171.45,88.9 90 top
RN6  171.45,58.42 90 top
X1  2.54,57.15 180 top

### Tracks (layer width: path | path; a pad name or v marks a point on that pad's centre or on a via)
-BUS-EN
  Top 0.152: JP1.1 11.43,102.87 11.43,86.36 X1.C28
  Bottom 0.152: IC3.2 29.53,19.37 31.43,19.37 31.43,16.51 30.48,15.56 22.23,15.56 22.23,62.23 12.7,71.75 12.7,85.41 11.75,86.36 X1.C28
-HI-RAM
  Top 0.152: IC6.10 39.37,87.63 107.95,87.63 IC2.20
-LO-RAM
  Top 0.152: IC10.3 34.29,101.6 109.22,101.6 IC1.20
-MEM-RD  (via drill 0.25)
  Top 0.152: IC5.1 51.44,60.33 v48.58,60.33 | X1.B23 6.35,74.93 6.35,77.47 4.76,77.47 3.81,78.42 3.81,82.55 24.45,82.55 25.4,81.6 v35.24,81.6
  Bottom 0.152: v48.58,60.33 42.23,60.33 42.23,71.12 39.05,74.3 39.05,80.33 36.51,82.87 | IC6.5 36.51,82.87 | 36.51,82.87 v35.24,81.6
-MEM-WR
  Bottom 0.152: IC6.9 37.15,92.39 37.15,106.05 35.56,107.63 11.11,107.63 11.11,101.6 6.35,96.84 6.35,88.58 7.3,87.63 7.94,87.63 8.89,86.68 8.89,86.04 9.84,85.09 12.06,85.09 12.06,79.06 10.48,77.47 7.62,77.47 X1.B24
-RESET
  Top 0.152: IC12.4 31.43,53.66 20,53.66 19.68,53.34 11.75,53.34 10.48,54.61 4.76,54.61 3.17,56.2 3.17,90.17 8.89,90.17 X1.C30
-ROM-CS  (via drill 0.25)
  Top 0.152: IC6.12 35.88,86.04 v42.23,86.04 | v55.56,39.69 56.52,38.73 91.12,38.73 92.08,37.78 111.44,37.78 IC13.20
  Bottom 0.152: v42.23,86.04 50.48,77.79 50.48,48.26 55.56,43.18 v55.56,39.69
-ROME000
  Top 0.152: IC10.12 32.07,107 73.34,107 IC7.9
-ROMF000
  Top 0.152: IC10.13 27.94,99.38 28.57,99.38 29.53,98.42 29.53,96.2 53.34,96.2 56.52,99.38 70.8,99.38 IC7.7
-TMP-REG-LD0  (via drill 0.25)
  Top 0.152: IC14.5 29.53,40.32 v21.59,40.32
  Bottom 0.152: v21.59,40.32 17.78,44.13 17.78,52.39 10.48,59.69 3.17,59.69 3.17,83.5 4.76,85.09 7.62,85.09 X1.B28
-TMP-REG-LD1  (via drill 0.25)
  Top 0.152: IC14.9 35.56,44.45 v28.89,44.45
  Bottom 0.152: v28.89,44.45 26.99,46.35 26.99,98.42 26.04,99.38 21.27,99.38 12.06,90.17 7.62,90.17 X1.B30
-TMP-REG-RD0
  Top 0.152: X1.B27 8.89,85.09 11.11,85.09 24.45,98.42 24.45,107.63 127.95,107.63 140.97,94.61 IC15.1
  Bottom 0.152: IC16.1 141.92,64.45 141.92,91.76 IC15.1
-TMP-REG-RD1  (via drill 0.25)
  Top 0.152: v14.61,87.63 21.91,94.93 126.68,94.93 140.97,80.64 IC17.1
  Bottom 0.152: IC19.1 140.02,49.21 140.02,79.06 IC17.1 | X1.B29 8.89,87.63 v14.61,87.63
-VMA  (via drill 0.25)
  Top 0.152: v33.02,45.72 X1.C12 | v56.83,44.77 55.56,43.5 40.01,43.5 39.05,42.55 39.05,40.32 34.61,40.32 IC14.11
  Bottom 0.152: 56.2,65.72 IC5.19 | 56.2,65.72 63.82,65.72 63.82,80.64 65.72,82.55 65.72,96.84 IC7.4 | IC3.1 32.07,24.45 32.07,40.96 IC14.11 v33.02,45.72 | 56.2,65.72 53.66,63.18 53.66,53.98 56.2,51.44 56.2,47.31 56.83,46.67 v56.83,44.77
ADDR0  (via drill 0.25)
  Top 0.152: v48.9,28.57 47.31,26.99 13.34,26.99 10.48,24.13 6.35,24.13 X1.A3
  Bottom 0.152: v48.9,28.57 IC8.2
ADDR1
  Top 0.152: IC8.4 58.1,32.7 12.06,32.7 10.48,34.29 7.3,34.29 6.35,33.34 6.35,31.75 4.76,31.75 3.81,30.8 3.81,25.4 X1.A4
ADDR2  (via drill 0.25)
  Top 0.152: IC8.6 61.59,31.11 v11.43,31.11
  Bottom 0.152: v11.43,31.11 11.43,30.16 10.48,29.21 5.08,29.21 X1.A5
ADDR3  (via drill 0.25)
  Top 0.152: IC8.8 66.04,30.48 v15.88,30.48
  Bottom 0.152: v15.88,30.48 13.34,33.02 11.43,33.02 11.43,32.7 10.48,31.75 5.08,31.75 X1.A6
ADDR4  (via drill 0.25)
  Top 0.152: v70.17,46.67 68.9,47.94 40.64,47.94 39.05,49.53 4.76,49.53 3.81,48.58 3.81,33.02 X1.A7
  Bottom 0.152: v70.17,46.67 IC8.11
ADDR5  (via drill 0.25)
  Top 0.152: v65.09,46.67 64.45,47.31 34.29,47.31 33.97,47.62 v16.51,47.62
  Bottom 0.152: v65.09,46.67 IC8.13 | v16.51,47.62 15.24,46.35 15.24,41.59 10.48,36.83 5.08,36.83 X1.A8
ADDR6  (via drill 0.25)
  Top 0.152: v60.01,46.67 33.97,46.67 33.66,46.99 v12.06,46.99
  Bottom 0.152: v60.01,46.67 IC8.15 | v12.06,46.99 6.35,46.99 6.35,39.37 X1.A9
ADDR7  (via drill 0.25)
  Top 0.152: v58.74,44.13 57.47,45.4 33.66,45.4 33.34,45.09 13.65,45.09 10.48,41.91 6.35,41.91 X1.A10
  Bottom 0.152: IC8.17 58.74,42.86 v58.74,44.13
ADDR8  (via drill 0.25)
  Top 0.152: v39.69,47.94 39.37,48.26 11.75,48.26 10.48,46.99 7.3,46.99 6.35,46.04 6.35,43.18 X1.A11
  Bottom 0.152: IC9.2 39.69,32.7 v39.69,47.94
ADDR9  (via drill 0.25)
  Top 0.152: IC9.4 58.1,19.37 47.94,19.37 47.62,19.05 41.59,19.05 41.27,19.37 v21.59,19.37
  Bottom 0.152: v21.59,19.37 21.59,25.72 13.02,34.29 3.81,34.29 3.81,44.45 X1.A12
ADDR10  (via drill 0.25)
  Top 0.152: IC9.6 63.18,16.19 13.34,16.19 10.48,19.05 v6.03,19.05
  Bottom 0.152: v6.03,19.05 3.17,19.05 3.17,46.35 X1.A13
ADDR11
  Top 0.152: IC9.8 66.04,21.59 4.76,21.59 3.17,23.18 3.17,50.8 X1.A14
ADDR12  (via drill 0.25)
  Top 0.152: v77.47,47.31 76.2,48.58 41.27,48.58 39.37,50.48 12.06,50.48 10.48,52.07 6.35,52.07 X1.A15
  Bottom 0.152: IC9.11 77.47,27.94 v77.47,47.31
ADDR13  (via drill 0.25)
  Top 0.152: v63.18,37.78 62.87,38.1 34.61,38.1 31.43,41.27 31.43,43.5 v14.61,43.5
  Bottom 0.152: IC9.13 63.18,32.07 v63.18,37.78 | v14.61,43.5 12.7,45.4 12.7,52.39 10.48,54.61 5.08,54.61 X1.A16
ADDR14  (via drill 0.25)
  Top 0.152: IC9.15 60.33,29.84 v21.59,29.84
  Bottom 0.152: v21.59,29.84 17.14,34.29 17.14,50.48 10.48,57.15 5.08,57.15 X1.A17
ADDR15  (via drill 0.25)
  Top 0.152: v58.1,55.88 57.15,56.83 v28.89,56.83 21.27,56.83 19.05,59.05 11.11,59.05 10.48,59.69 6.35,59.69 X1.A18
  Bottom 0.152: IC9.17 58.1,26.99 v58.1,55.88 | IC10.4 32.7,97.47 32.7,95.89 28.89,92.08 v28.89,56.83
BADDR0  (via drill 0.25)
  Top 0.152: IC8.18 58.74,43.5 v78.74,43.5 | IC13.10 115.57,25.4 108.58,32.38 v95.57,32.38
  Bottom 0.152: IC13.10 116.52,25.08 116.52,66.36 | IC2.10 116.52,66.36 | IC1.10 116.52,89.22 116.52,66.36 | v78.74,43.5 86.36,35.88 86.36,28.26 88.9,25.72 | 88.9,25.72 96.52,18.1 100.33,18.1 RN1.2 | 88.9,25.72 v95.57,32.38
BADDR1  (via drill 0.25)
  Top 0.152: v73.34,23.18 73.98,22.54 96.2,22.54 100.65,18.1 101.28,18.1 RN1.3
  Bottom 0.152: IC1.9 112.08,89.22 112.08,68.26 IC2.9 113.98,66.36 113.98,23.18 | RN1.3 103.19,16.19 103.19,14.61 103.5,14.29 113.98,14.29 113.98,23.18 | IC13.9 113.98,23.18 | IC8.16 68.9,35.24 68.9,31.11 73.34,26.67 v73.34,23.18
BADDR2  (via drill 0.25)
  Top 0.152: v108.58,20.32 105.41,20.32 RN1.4 103.82,14.92 80.96,14.92 v73.98,21.91
  Bottom 0.152: IC1.8 111.44,89.22 111.44,68.26 IC2.8 111.44,66.36 111.44,25.08 IC13.8 110.49,22.23 v108.58,20.32 | IC8.14 73.98,35.24 v73.98,21.91
BADDR3  (via drill 0.25)
  Top 0.152: v76.83,35.24 80.33,31.75 108.27,31.75 110.81,29.21 110.81,25.72 109.54,25.72 IC13.7
  Bottom 0.152: IC1.7 108.9,89.22 108.9,68.26 IC2.7 108.9,66.36 108.9,25.08 IC13.7 RN1.5 | IC8.12 76.83,37.47 v76.83,35.24
BADDR4  (via drill 0.25)
  Top 0.152: IC8.9 77.47,29.21 109.86,29.21 110.17,28.89 110.17,26.35 107.63,26.35 IC13.6 | v107.31,19.68 RN1.6
  Bottom 0.152: IC1.6 106.36,89.22 106.36,68.26 IC2.6 106.36,66.36 106.36,20.64 | 106.36,20.64 105.41,21.59 IC13.6 | 106.36,20.64 v107.31,19.68
BADDR5  (via drill 0.25)
  Top 0.152: IC8.7 68.9,35.88 v102.55,35.88
  Bottom 0.152: IC1.5 103.82,89.22 103.82,68.26 IC2.5 103.82,66.36 103.82,37.15 v102.55,35.88 102.87,35.56 IC13.5 103.82,23.18 103.82,14.92 111.44,14.92 RN1.7
BADDR6  (via drill 0.25)
  Top 0.152: IC8.5 64.45,36.51 v100.33,36.51 | RN1.8 110.17,21.91 97.79,21.91 96.84,22.86 96.84,25.72 98.74,25.72 IC13.4
  Bottom 0.152: IC1.4 101.28,89.22 101.28,68.26 IC2.4 101.28,66.36 101.28,37.47 v100.33,36.51 IC13.4
BADDR7
  Top 0.152: IC8.3 60.01,37.15 104.78,37.15 117.16,24.77 117.16,22.54 | 117.16,22.54 117.16,16.51 RN1.9 | IC13.3 99.38,22.54 117.16,22.54
  Bottom 0.152: IC1.3 98.74,89.22 98.74,68.26 IC2.3 97.47,66.99 97.47,48.9 96.84,48.26 96.84,25.08 IC13.3
BADDR8  (via drill 0.25)
  Top 0.152: IC9.18 58.74,23.81 90.17,23.81 93.66,27.3 v97.47,27.3
  Bottom 0.152: IC1.25 99.38,104.46 99.38,83.5 IC2.25 99.38,81.6 99.38,47.94 RN2.2 IC13.25 99.69,38.73 99.69,29.53 v97.47,27.3
BADDR9
  Bottom 0.152: IC1.24 101.92,104.46 101.92,83.5 IC2.24 101.92,81.6 101.92,47.94 RN2.3 IC13.24 101.92,38.42 101.92,13.97 71.44,13.97 68.9,16.51 68.9,18.73 IC9.16
BADDR10  (via drill 0.25)
  Top 0.152: IC9.14 70.48,28.57 v109.54,28.57 | v105.73,43.5 108.27,40.96 108.9,40.96 IC13.21
  Bottom 0.152: IC1.21 109.54,104.46 109.54,83.5 IC2.21 109.54,81.6 109.54,40.32 IC13.21 110.49,29.53 v109.54,28.57 | RN2.4 105.73,46.67 v105.73,43.5
BADDR11  (via drill 0.25)
  Top 0.152: IC9.12 74.93,27.94 v103.5,27.94 | RN2.5 106.36,48.58 v104.46,48.58
  Bottom 0.152: IC1.23 104.46,104.46 104.46,83.5 IC2.23 104.46,81.6 v104.46,48.58 104.46,40.32 IC13.23 105.41,29.84 v103.5,27.94
BADDR12  (via drill 0.25)
  Top 0.152: v30.8,71.12 32.07,72.39 v51.75,72.39 | RN2.6 108.9,45.4 v96.2,45.4 | v56.2,88.58 93.66,88.58 IC1.2
  Bottom 0.152: IC11.4 30.8,67.63 v30.8,71.12 | v51.75,72.39 56.2,76.83 v56.2,88.58 56.2,96.84 IC7.1 | IC13.2 96.2,25.08 v96.2,45.4 96.2,66.36 | IC2.2 96.2,66.36 | IC1.2 96.2,89.22 96.2,66.36
BADDR13  (via drill 0.25)
  Top 0.152: IC11.7 39.05,68.26 39.37,68.26 40.32,69.22 56.2,69.22 | v57.78,69.22 56.2,69.22 | RN2.7 110.81,49.21 v96.84,49.21 | 56.2,69.22 56.2,63.18 v96.84,63.18
  Bottom 0.152: v57.78,69.22 58.74,70.17 58.74,96.84 IC7.2 | 96.84,83.5 IC2.26 | 96.84,83.5 96.84,104.46 IC1.26 | 96.84,83.5 v96.84,63.18 v96.84,49.21
BADDR14  (via drill 0.25)
  Top 0.152: RN2.8 112.71,49.85 v94.61,49.85 | v62.55,94.3 63.18,93.66 89.22,93.66 IC1.1
  Bottom 0.152: IC11.9 39.69,75.88 39.69,106.68 40.01,107 61.28,107 61.28,98.74 IC7.3 62.55,97.47 v62.55,94.3 | IC1.1 91.76,89.22 91.76,68.26 IC2.1 92.71,51.75 v94.61,49.85
BADDR15  (via drill 0.25)
  Top 0.152: RN2.9 118.11,51.12 82.23,51.12 77.15,46.04 33.66,46.04 33.34,46.35 v32.38,46.35 | IC7.6 67.63,95.57 v34.61,95.57
  Bottom 0.152: IC14.3 31.43,35.24 31.43,46.35 | 31.43,46.35 31.43,52.07 32.07,52.7 32.07,73.98 IC11.12 33.97,75.88 33.97,94.93 v34.61,95.57 | 31.43,46.35 v32.38,46.35
BDATA0  (via drill 0.25)
  Top 0.152: IC5.18 60.64,63.82 v117.79,63.82
  Bottom 0.152: RN4.2 IC5.18 | IC13.11 119.06,25.08 119.06,63.82 | 119.06,66.36 119.06,63.82 | IC2.11 119.06,66.36 | IC1.11 119.06,89.22 119.06,66.36 | 119.06,63.82 v117.79,63.82
BDATA1
  Top 0.152: IC5.17 61.28,68.9 88.9,68.9 92.08,65.72 119.06,65.72 IC2.12
  Bottom 0.152: RN4.3 IC5.17 | IC13.12 121.6,25.08 121.6,66.36 | IC2.12 121.6,66.36 | IC1.12 121.6,89.22 121.6,66.36
BDATA2
  Top 0.152: IC5.16 65.09,64.45 120.33,64.45 IC2.13
  Bottom 0.152: RN4.4 IC5.16 | IC13.13 124.14,25.08 124.14,66.36 | IC2.13 124.14,66.36 | IC1.13 124.14,89.22 124.14,66.36
BDATA3
  Top 0.152: RN4.5 68.26,80.96 124.14,80.96 IC2.15
  Bottom 0.152: RN4.5 IC5.15 | IC13.15 124.78,40.32 124.78,81.6 | IC2.15 124.78,81.6 | IC1.15 124.78,104.46 124.78,81.6
BDATA4
  Top 0.152: RN4.6 70.17,80.33 125.73,80.33 126.68,81.28 126.68,84.14 124.78,84.14 IC2.16
  Bottom 0.152: RN4.6 IC5.14 | IC13.16 122.24,40.32 122.24,81.6 | IC2.16 122.24,81.6 | IC1.16 122.24,104.46 122.24,81.6
BDATA5
  Top 0.152: RN4.7 72.07,79.69 126.05,79.69 127.32,80.96 127.32,84.77 122.87,84.77 IC2.17
  Bottom 0.152: RN4.7 IC5.13 | IC13.17 119.7,40.32 119.7,81.6 | IC2.17 119.7,81.6 | IC1.17 119.7,104.46 119.7,81.6
BDATA6  (via drill 0.25)
  Top 0.152: IC5.12 74.61,65.09 v117.16,65.09
  Bottom 0.152: RN4.8 IC5.12 | IC13.18 117.16,40.32 v117.16,65.09 117.16,81.6 | IC2.18 117.16,81.6 | IC1.18 117.16,104.46 117.16,81.6
BDATA7  (via drill 0.25)
  Top 0.152: RN4.9 75.56,78.11 v112.71,78.11
  Bottom 0.152: RN4.9 IC5.11 | IC13.19 114.62,40.32 114.62,78.11 | 114.62,81.6 114.62,78.11 | IC2.19 114.62,81.6 | IC1.19 114.62,104.46 114.62,81.6 | 114.62,78.11 v112.71,78.11
DATA0  (via drill 0.25)
  Top 0.152: IC15.3 IC15.2 | RN5.2 168.59,78.42 147.64,78.42 IC17.3 IC17.2 143.51,72.71 88.58,72.71 87.31,71.44 v69.22,71.44 | X1.A19 6.35,62.23 45.09,62.23 46.35,60.96 51.12,60.96 51.44,61.28 53.02,61.28 IC5.2
  Bottom 0.152: IC15.2 142.56,91.76 142.56,80.96 IC17.2 | RN3.2 56.83,51.12 56.83,57.47 IC5.2 54.61,61.28 60.96,61.28 65.72,66.04 65.72,79.06 67.94,79.06 68.26,78.74 68.26,72.39 v69.22,71.44
DATA1  (via drill 0.25)
  Top 0.152: IC15.5 IC15.4 | IC17.4 IC17.5 153.35,82.23 169.86,82.23 RN5.3 | X1.A20 6.35,64.77 45.09,64.77 46.35,63.5 52.7,63.5 54.93,61.28 55.56,61.28 IC5.3 | v141.29,53.98 139.38,52.07 78.42,52.07 75.56,49.21 61.28,49.21 RN3.3
  Bottom 0.152: IC15.4 147.64,91.76 147.64,80.96 IC17.4 142.56,73.98 142.56,55.24 v141.29,53.98 | RN3.3 58.74,51.75 58.74,58.1 IC5.3
DATA2  (via drill 0.25)
  Top 0.152: IC17.7 IC17.6 | IC15.6 IC15.7 159.7,89.22 168.59,89.22 RN5.4 | X1.A21 6.35,67.31 20.64,67.31 22.23,65.72 46.04,65.72 46.35,66.04 51.12,66.04 55.24,61.91 57.47,61.91 | IC5.4 57.47,61.91 | v154.62,67.63 154.31,67.31 128.91,67.31 123.51,61.91 57.47,61.91
  Bottom 0.152: IC15.6 154.62,91.76 154.62,80.96 IC17.6 154.62,79.06 v154.62,67.63 | RN3.4 59.69,53.34 IC5.4
DATA3  (via drill 0.25)
  Top 0.152: IC17.9 IC17.8 | IC15.8 IC15.9 162.88,91.12 169.23,91.12 RN5.5 | v21.27,61.59 24.77,58.1 60.64,58.1 IC5.5 63.82,61.28 133.03,61.28 136.84,65.09 156.53,65.09 v159.7,68.26
  Bottom 0.152: IC15.8 159.7,91.76 159.7,80.96 IC17.8 159.7,79.06 v159.7,68.26 | RN3.5 62.23,53.34 IC5.5 | X1.A22 6.35,69.85 13.65,69.85 13.65,69.22 v21.27,61.59
DATA4
  Top 0.152: IC15.12 IC15.13 | IC17.13 IC17.12 163.51,85.41 173.04,85.41 | RN5.6 173.04,89.85 173.04,85.41 | X1.A23 3.81,72.39 3.81,57.15 17.14,57.15 18.41,55.88 57.15,55.88 60.64,52.39 65.72,52.39 RN3.6 73.98,57.47 151.76,57.47 153.03,58.74 161.29,58.74 167,64.45 173.04,64.45 173.04,85.41
  Bottom 0.152: IC15.13 157.8,99.38 157.8,88.58 IC17.13 | RN3.6 64.77,53.34 IC5.6
DATA5  (via drill 0.25)
  Top 0.152: IC17.14 IC17.15 | IC15.14 IC15.15 | v20.64,59.37 22.54,57.47 65.09,57.47 65.72,58.1 | IC5.7 65.72,58.1 | v155.26,61.91 151.76,58.42 75.88,58.42 75.56,58.1 65.72,58.1
  Bottom 0.152: RN5.7 164.78,100.65 164.78,101.6 164.47,101.92 157.16,101.92 | 157.16,101.92 156.21,101.92 IC15.14 | 157.16,101.92 157.16,88.58 IC17.14 155.26,86.68 v155.26,61.91 | RN3.7 67.31,53.34 IC5.7 | X1.A24 3.81,74.93 3.81,63.18 4.76,62.23 17.78,62.23 v20.64,59.37
DATA6  (via drill 0.25)
  Top 0.152: IC17.16 IC17.17 141.92,80.96 141.92,74.93 71.75,74.93 v67.94,71.12 57.78,71.12 52.39,76.52 30.8,76.52 29.84,77.47 7.3,77.47 6.67,78.11 5.71,78.11 X1.A25 | IC15.16 IC15.17
  Bottom 0.152: RN5.8 165.42,102.55 152.08,102.55 | 152.08,102.55 151.13,102.55 IC15.16 | IC17.16 152.08,88.58 152.08,102.55 | RN3.8 69.85,53.34 IC5.8 68.9,60.64 68.9,70.17 v67.94,71.12
DATA7  (via drill 0.25)
  Top 0.152: IC17.18 IC17.19 | IC15.19 IC15.18 147.64,98.74 171.13,98.74 RN5.9 | X1.A26 6.35,80.01 v64.45,80.01
  Bottom 0.152: IC17.19 144.46,88.58 144.46,99.38 IC15.19 136.84,107 73.98,107 73.98,81.92 71.44,79.38 | RN3.9 72.39,53.34 IC5.9 71.44,60.64 71.44,79.38 | v64.45,80.01 71.44,80.01 71.44,79.38
DATA8  (via drill 0.25)
  Top 0.152: IC16.3 IC16.2 | IC19.2 IC19.3 148.27,50.48 171.13,50.48 RN6.2 | v11.43,79.38 12.7,78.11 30.16,78.11 31.11,77.15 52.7,77.15 53.98,75.88 85.41,75.88 87,77.47 v125.41,77.47
  Bottom 0.152: X1.A27 6.35,82.55 11.43,82.55 v11.43,79.38 | v125.41,77.47 126.68,76.2 126.68,62.55 125.73,61.59 125.73,59.05 138.11,46.67 143.51,46.67 IC19.2 | IC16.3 145.1,62.55 145.1,49.21 IC19.3
DATA9  (via drill 0.25)
  Top 0.152: IC16.5 IC16.4 | IC19.5 IC19.4 147,46.67 142.56,46.67 | RN6.3 169.23,51.12 144.15,51.12 142.56,49.53 142.56,46.67 | v6.99,14.29 118.11,14.29 142.56,38.73 142.56,46.67
  Bottom 0.152: X1.A28 2.54,83.82 2.54,18.73 v6.99,14.29 | IC16.4 149.54,62.55 149.54,49.21 IC19.4
DATA10
  Top 0.152: IC19.6 IC19.7 157.8,49.85 173.04,49.85 173.04,54.29 RN6.4 | IC16.7 IC16.6
  Bottom 0.152: X1.A29 3.81,90.17 3.81,98.11 6.35,100.65 6.35,110.81 7.3,111.76 149.54,111.76 149.54,74.93 152.72,71.75 152.72,64.45 IC16.6 154.62,62.55 154.62,49.21 IC19.6
DATA11
  Top 0.152: IC16.9 IC16.8 | IC19.9 IC19.8 | X1.A30 0.64,95.89 0.64,111.12 127.95,111.12 144.15,94.93 172.72,94.93 174.31,93.34 174.31,58.42 RN6.5
  Bottom 0.152: IC19.9 162.24,49.21 | 162.24,49.21 RN6.5 | IC16.9 162.24,62.55 162.24,49.21
DATA12
  Top 0.152: IC16.12 IC16.13 | IC19.13 IC19.12 162.88,57.47 167.96,57.47 RN6.6
  Bottom 0.152: X1.B3 8.89,21.59 8.89,17.46 16.83,9.53 157.8,9.53 157.8,54.93 | IC19.13 157.8,54.93 | IC16.13 157.8,70.17 157.8,54.93
DATA13
  Top 0.152: IC16.14 IC16.15 | IC19.15 IC19.14 158.43,58.1 166.05,58.1 RN6.7
  Bottom 0.152: X1.B4 8.89,24.13 18.41,24.13 18.41,17.46 23.18,12.7 152.72,12.7 152.72,54.93 IC19.15 | IC16.14 157.16,70.17 157.16,56.83 IC19.14
DATA14  (via drill 0.25)
  Top 0.152: IC16.16 IC16.17 | RN6.8 168.59,68.9 v152.08,68.9 | IC19.16 IC19.17
  Bottom 0.152: 151.76,69.22 151.13,69.85 IC16.16 | 151.76,69.22 v152.08,68.9 | X1.B5 8.89,26.67 19.05,26.67 19.05,17.78 23.5,13.34 147.64,13.34 147.64,54.93 | IC19.17 147.64,54.93 | 151.76,69.22 147.64,65.09 147.64,54.93
DATA15  (via drill 0.25)
  Top 0.152: IC16.19 IC16.18 147.64,72.71 167.32,72.71 RN6.9 | IC19.18 144.46,55.88 | 144.46,55.88 IC19.19 | X1.B6 8.89,31.75 v58.74,31.75 | v60.64,44.13 61.28,44.77 133.35,44.77 144.46,55.88
  Bottom 0.152: v58.74,31.75 60.64,31.75 v60.64,44.13 | IC16.19 144.46,70.17 144.46,56.83 IC19.19
FORCE-ROM  (via drill 0.25)
  Top 0.152: IC12.5 33.02,54.61 v25.72,54.61
  Bottom 0.152: v25.72,54.61 22.86,57.47 IC11.1
GND
  pour Route2: 0,113.03 176.53,113.03 176.53,0 0,0 0,8.89 6.35,8.89 6.35,16.51 0,16.51 0,97.79 6.35,97.79 6.35,105.41 0,105.41
MEM-RD
  Top 0.152: IC6.1 26.99,85.41 36.51,85.41 IC6.6
N$1
  Bottom 0.152: IC6.13 28.26,91.76 28.26,93.34 32.07,97.16 32.07,104.46 IC10.11
N$2
  Route2 0.152: IC6.3 36.51,89.85 39.05,89.85 40.32,91.12 40.32,91.44 IC6.8
N$3
  Top 0.152: IC6.2 29.53,82.23 55.88,82.23 59.05,85.41 105.09,85.41 IC2.22
  Bottom 0.152: IC13.22 107,40.32 107,81.6 | IC2.22 107,81.6 | IC1.22 107,104.46 107,81.6
N$4  (via drill 0.25)
  Top 0.152: v33.34,78.74 53.66,78.74 54.29,79.38 65.72,79.38 68.58,82.23 90.17,82.23 92.08,84.14 93.66,84.14 IC2.27
  Bottom 0.152: IC6.4 33.34,83.5 v33.34,78.74 | IC13.27 95.25,65.09 94.3,66.04 94.3,81.6 | IC2.27 94.3,81.6 | IC1.27 94.3,104.46 94.3,81.6
N$5
  Bottom 0.152: IC4.11 67.63,91.12 67.63,85.72 68.9,84.45 68.9,82.55 69.22,82.23 73.34,82.23 73.34,104.46 IC7.10
N$6
  Bottom 0.152: IC4.6 70.8,85.41 70.8,104.46 IC7.11
N$7
  Bottom 0.152: IC4.5 69.53,84.14 69.53,89.53 68.26,90.81 68.26,104.46 IC7.12
N$8
  Bottom 0.152: IC4.4 66.36,84.77 66.36,103.19 64.77,104.78 IC7.13
N$9
  Bottom 0.152: IC4.3 63.18,85.41 63.18,104.46 IC7.14
N$10
  Bottom 0.152: IC4.2 60.64,85.41 60.64,104.46 IC7.15
N$11
  Top 0.152: R2.1 166.05,4.76 174.31,4.76 PWR.A
N$12
  Bottom 0.152: IC14.10 34.61,42.86 34.61,94.61 36.51,96.52 36.51,102.23 33.97,104.78 33.97,106.68 33.66,107 28.89,107 28.89,98.74 IC10.2
N$13  (via drill 0.25)
  Top 0.152: v28.89,38.42 IC14.4
  Bottom 0.152: v28.89,38.42 26.35,40.96 26.35,96.84 IC10.1
N$14
  Top 0.152: IC6.11 34.61,93.03 73.34,93.03 IC4.8
N$15  (via drill 0.25)
  Top 0.152: v78.11,70.48 28.57,70.48 IC11.2
  Bottom 0.152: IC9.9 78.11,23.5 v78.11,70.48
N$16
  Bottom 0.152: IC9.7 65.09,15.56 33.97,15.56 33.97,66.36 IC11.5
N$17
  Bottom 0.152: IC9.5 60.64,16.19 55.56,16.19 55.56,36.2 41.59,50.16 41.59,68.9 IC11.11
N$18  (via drill 0.25)
  Top 0.152: v51.12,73.34 29.53,73.34 IC11.14
  Bottom 0.152: IC9.3 56.2,18.73 56.2,46.35 51.12,51.44 v51.12,73.34
N$19  (via drill 0.25)
  Top 0.152: v31.43,77.79 33.02,79.38 v40.32,79.38
  Bottom 0.152: IC12.3 31.43,53.02 v31.43,77.79 | v40.32,79.38 41.59,80.64 41.59,104.46 IC10.8
N$20
  Top 0.152: IC10.9 IC10.10
  Bottom 0.152: IC10.9 IC10.6
N$21  (via drill 0.25)
  Top 0.152: v39.05,68.9 40.01,69.85 140.02,69.85 140.34,69.53 162.24,69.53 IC16.11
  Bottom 0.152: IC14.6 39.05,35.24 v39.05,68.9 | IC15.11 164.78,99.38 164.78,72.07 IC16.11
N$22
  Bottom 0.152: IC14.2 29.53,35.88 29.53,88.27 32.07,90.81 32.07,94.3 IC10.5
N$23
  Top 0.152: IC14.8 41.91,40.64 51.12,40.64 51.44,40.32 91.44,40.32 95.25,44.13 134.62,44.13 144.78,54.29 162.24,54.29 IC19.11
  Bottom 0.152: IC17.11 162.88,86.68 162.88,56.83 IC19.11
N$24
  Bottom 0.152: IC7.5 66.99,98.11 66.99,103.5 65.72,104.78 65.72,106.68 61.28,111.12 7.62,111.12 JP1.2
N$25
  Bottom 0.152: IC3.3 28.89,16.19 24.45,16.19 24.45,33.34 IC14.1
VCC
  pour Route15: 0,113.03 176.53,113.03 176.53,0 0,0 0,8.89 6.35,8.89 6.35,16.51 0,16.51 0,97.79 6.35,97.79 6.35,105.41 0,105.41

### Text on the board
tNames: -BUS-EN | Gnd | YACC1 MEMORY BOARD V1.2 | 0 | onepagecomputer.com